# EAGLE design Audio Spektrum Analysator (EAGLE 9.1.1)
ERSTELLER: Jakob Holz; PROJEKT: Audio Spektrumanalysator; VERSION: 1.0

## Sheet 1 of 5
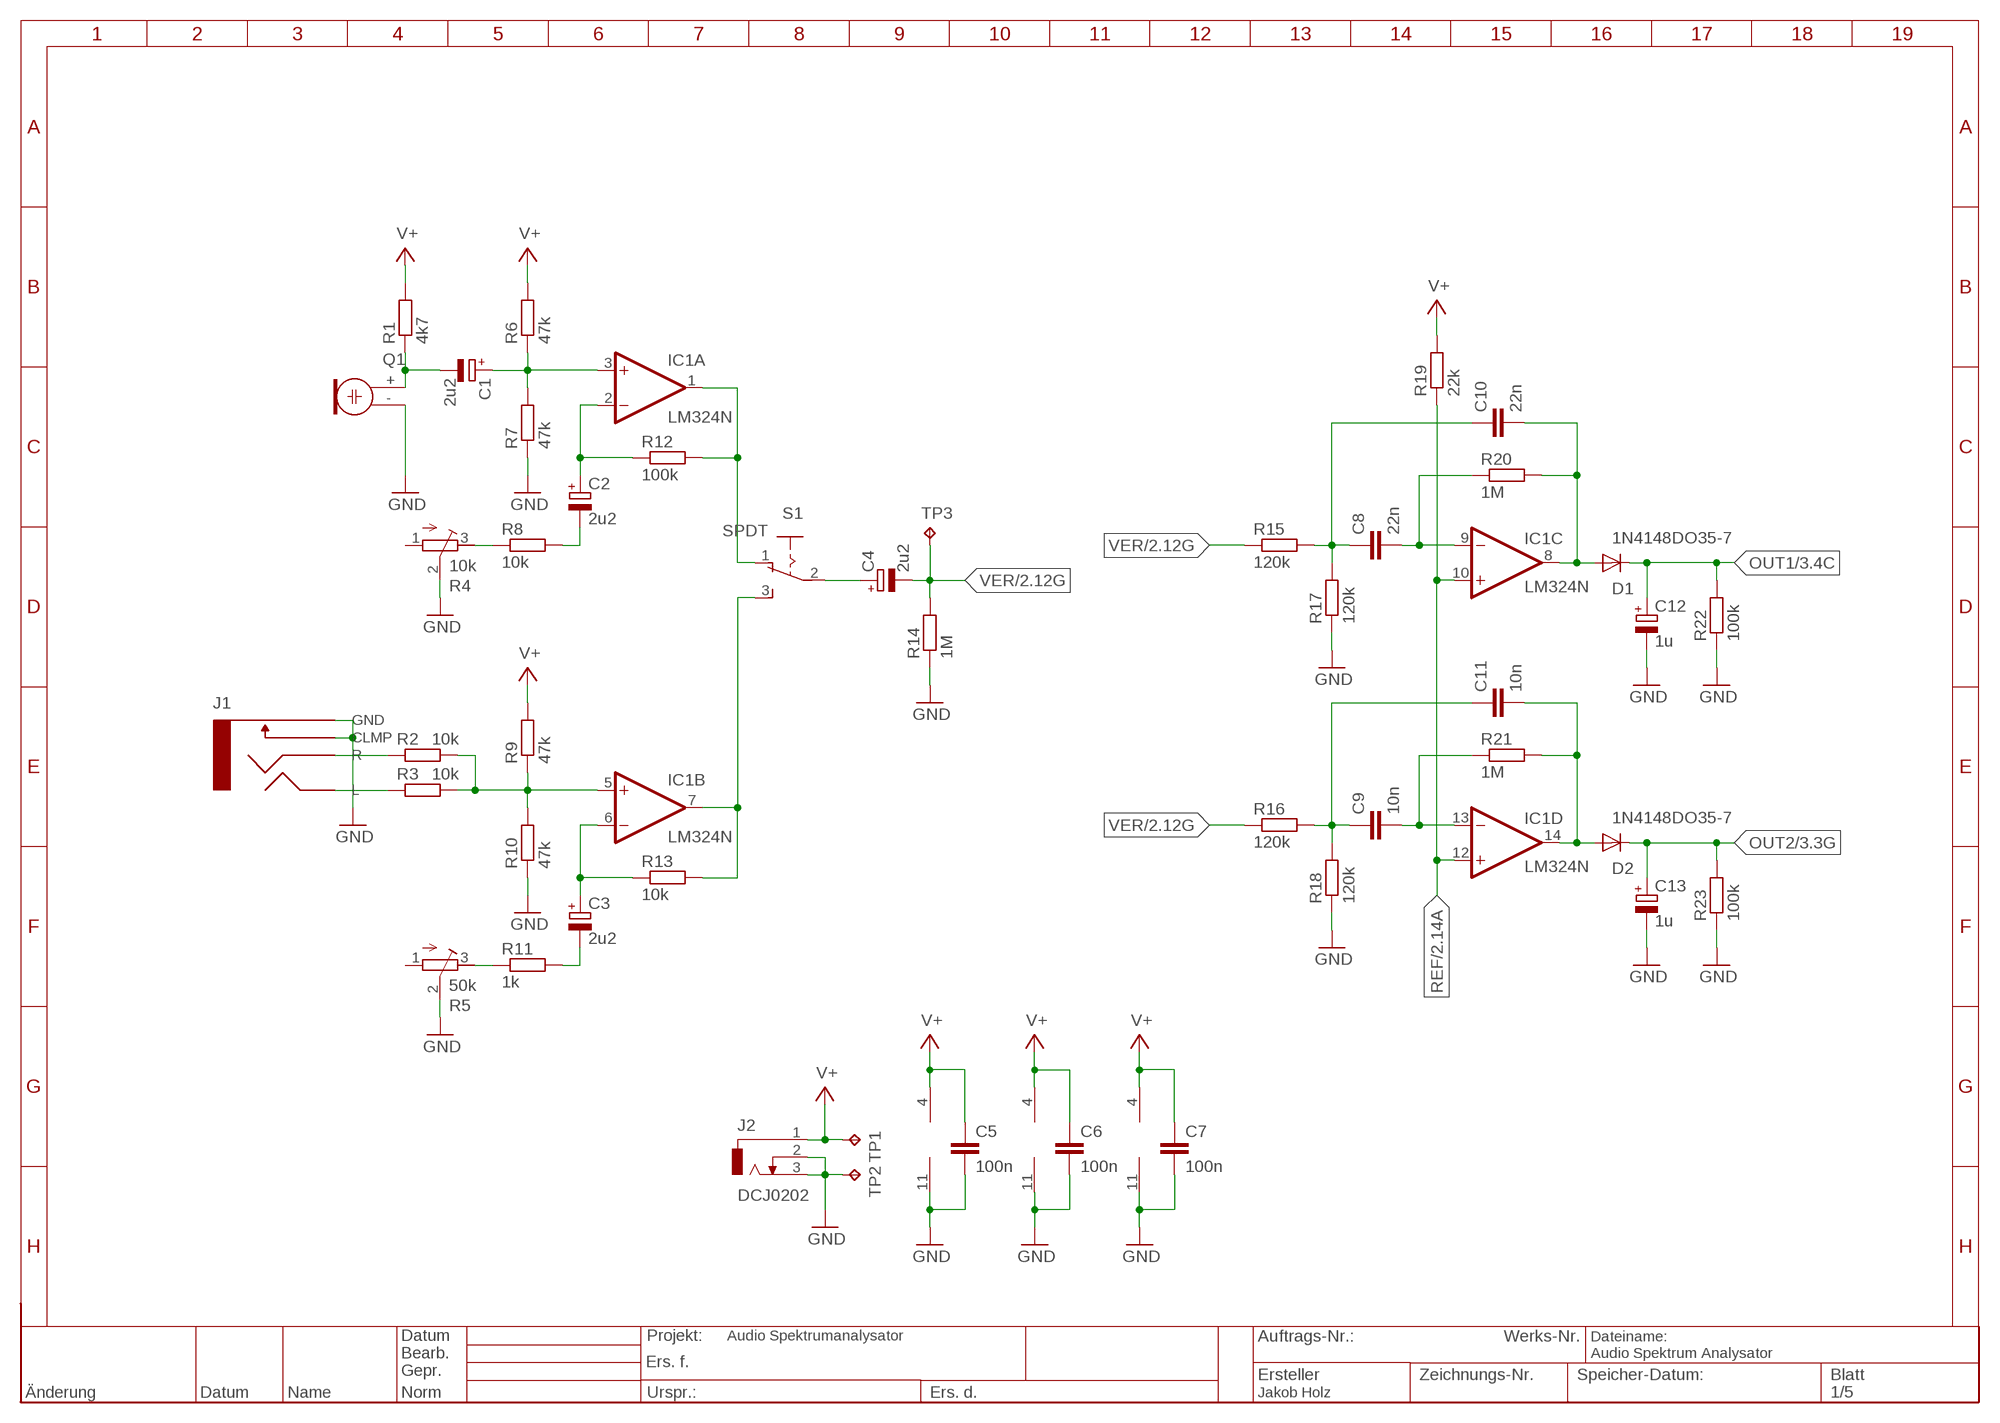
[diagram p0: schematic, sheet 1]

### Parts
C1  2u2  CPOL-EUE2.5-5  [E2,5-5]
C2  2u2  CPOL-EUE2.5-5  [E2,5-5]
C3  2u2  CPOL-EUE2.5-5  [E2,5-5]
C4  2u2  CPOL-EUE2.5-5  [E2,5-5]
C5  100n  C-EU050-024X044  [C050-024X044]
C6  100n  C-EU050-024X044  [C050-024X044]
C7  100n  C-EU050-024X044  [C050-024X044]
C8  22n  C-EU025-024X044  [C025-024X044]
C9  10n  C-EU025-024X044  [C025-024X044]
C10  22n  C-EU025-024X044  [C025-024X044]
C11  10n  C-EU025-024X044  [C025-024X044]
C12  1u  CPOL-EUE2.5-5  [E2,5-5]
C13  1u  CPOL-EUE2.5-5  [E2,5-5]
D1  1N4148DO35-7  [DO35-7]
D2  1N4148DO35-7  [DO35-7]
IC1  LM324N  [DIL14]
IC2  LM324N  [DIL14]
IC3  LM324N  [DIL14]
J1  2.5MM-AUXS  [2,5MM-AUX_JACK]
J2  DCJ0202  [DCJ0202]
Q1  ELECTRET  [9.7ELECTRET]
R1  4k7  R-EU_0207/7  [0207/7]
R2  10k  R-EU_0207/7  [0207/7]
R3  10k  R-EU_0207/7  [0207/7]
R4  10k  R-TRIMM64W  [RTRIM64W]
R5  50k  R-TRIMM64W  [RTRIM64W]
R6  47k  R-EU_0207/7  [0207/7]
R7  47k  R-EU_0207/7  [0207/7]
R8  10k  R-EU_0207/7  [0207/7]
R9  47k  R-EU_0207/7  [0207/7]
R10  47k  R-EU_0207/7  [0207/7]
R11  1k  R-EU_0207/7  [0207/7]
R12  100k  R-EU_0207/7  [0207/7]
R13  10k  R-EU_0207/7  [0207/7]
R14  1M  R-EU_0207/7  [0207/7]
R15  120k  R-EU_0207/7  [0207/7]
R16  120k  R-EU_0207/7  [0207/7]
R17  120k  R-EU_0207/7  [0207/7]
R18  120k  R-EU_0207/7  [0207/7]
R19  22k  R-EU_0207/7  [0207/7]
R20  1M  R-EU_0207/7  [0207/7]
R21  1M  R-EU_0207/7  [0207/7]
R22  100k  R-EU_0207/7  [0207/7]
R23  100k  R-EU_0207/7  [0207/7]
S1  SPDT  [SPDT]
TP1  TPPAD1-20  [P1-20]
TP2  TPPAD1-20  [P1-20]
TP3  TPPAD1-20  [P1-20]

### Nets
GND: C5.2 C6.2 C7.2 C12.- C13.- IC1.11(P:V-) IC2.11(P:V-) IC3.11(P:V-) J1.1(GND) J1.4(CLMP) J2.2 J2.3 Q1.- R4.2(S) R5.2(S) R7.1 R10.1 R14.1 R17.1 R18.1 R22.1 R23.1 TP2.TP ; also sheet 2,3,4,5
N$1: J1.2(R) R2.1
N$2: J1.3(L) R3.1
N$3: IC1.5(B:+IN) R2.2 R3.2 R9.1 R10.2
N$4: C1.+ IC1.3(A:+IN) R6.1 R7.2
N$5: C2.+ IC1.2(A:-IN) R12.1
N$6: IC1.1(A:OUT) R12.2 S1.1
N$10: IC1.7(B:OUT) R13.2 S1.3
N$12: C4.+ S1.2
N$13: C1.- Q1.+ R1.1
N$31: C2.- R8.2
N$44: R4.3(E) R8.1
N$57: C3.+ IC1.6(B:-IN) R13.1
N$70: C3.- R11.2
N$83: R5.3(E) R11.1
N$133: C10.2 D1.A IC1.8(C:OUT) R20.2
N$134: C8.2 IC1.9(C:-IN) R20.1
N$136: C8.1 C10.1 R15.2 R17.2
N$138: C11.2 D2.A IC1.14(D:OUT) R21.2
N$139: C9.2 IC1.13(D:-IN) R21.1
N$141: C9.1 C11.1 R16.2 R18.2
OUT1: C12.+ D1.C R22.2 ; also sheet 3
OUT2: C13.+ D2.C R23.2 ; also sheet 3
REF: IC1.10(C:+IN) IC1.12(D:+IN) R19.1 ; also sheet 2
V+ [V+]: C5.1 C6.1 C7.1 IC1.4(P:V+) IC2.4(P:V+) IC3.4(P:V+) J2.1 R1.2 R6.2 R9.2 R19.2 TP1.TP ; also sheet 3,4,5
VER: C4.- R14.2 R15.1 R16.1 TP3.TP ; also sheet 2
Unconnected: R4.1(A) R5.1(A)

## Sheet 2 of 5
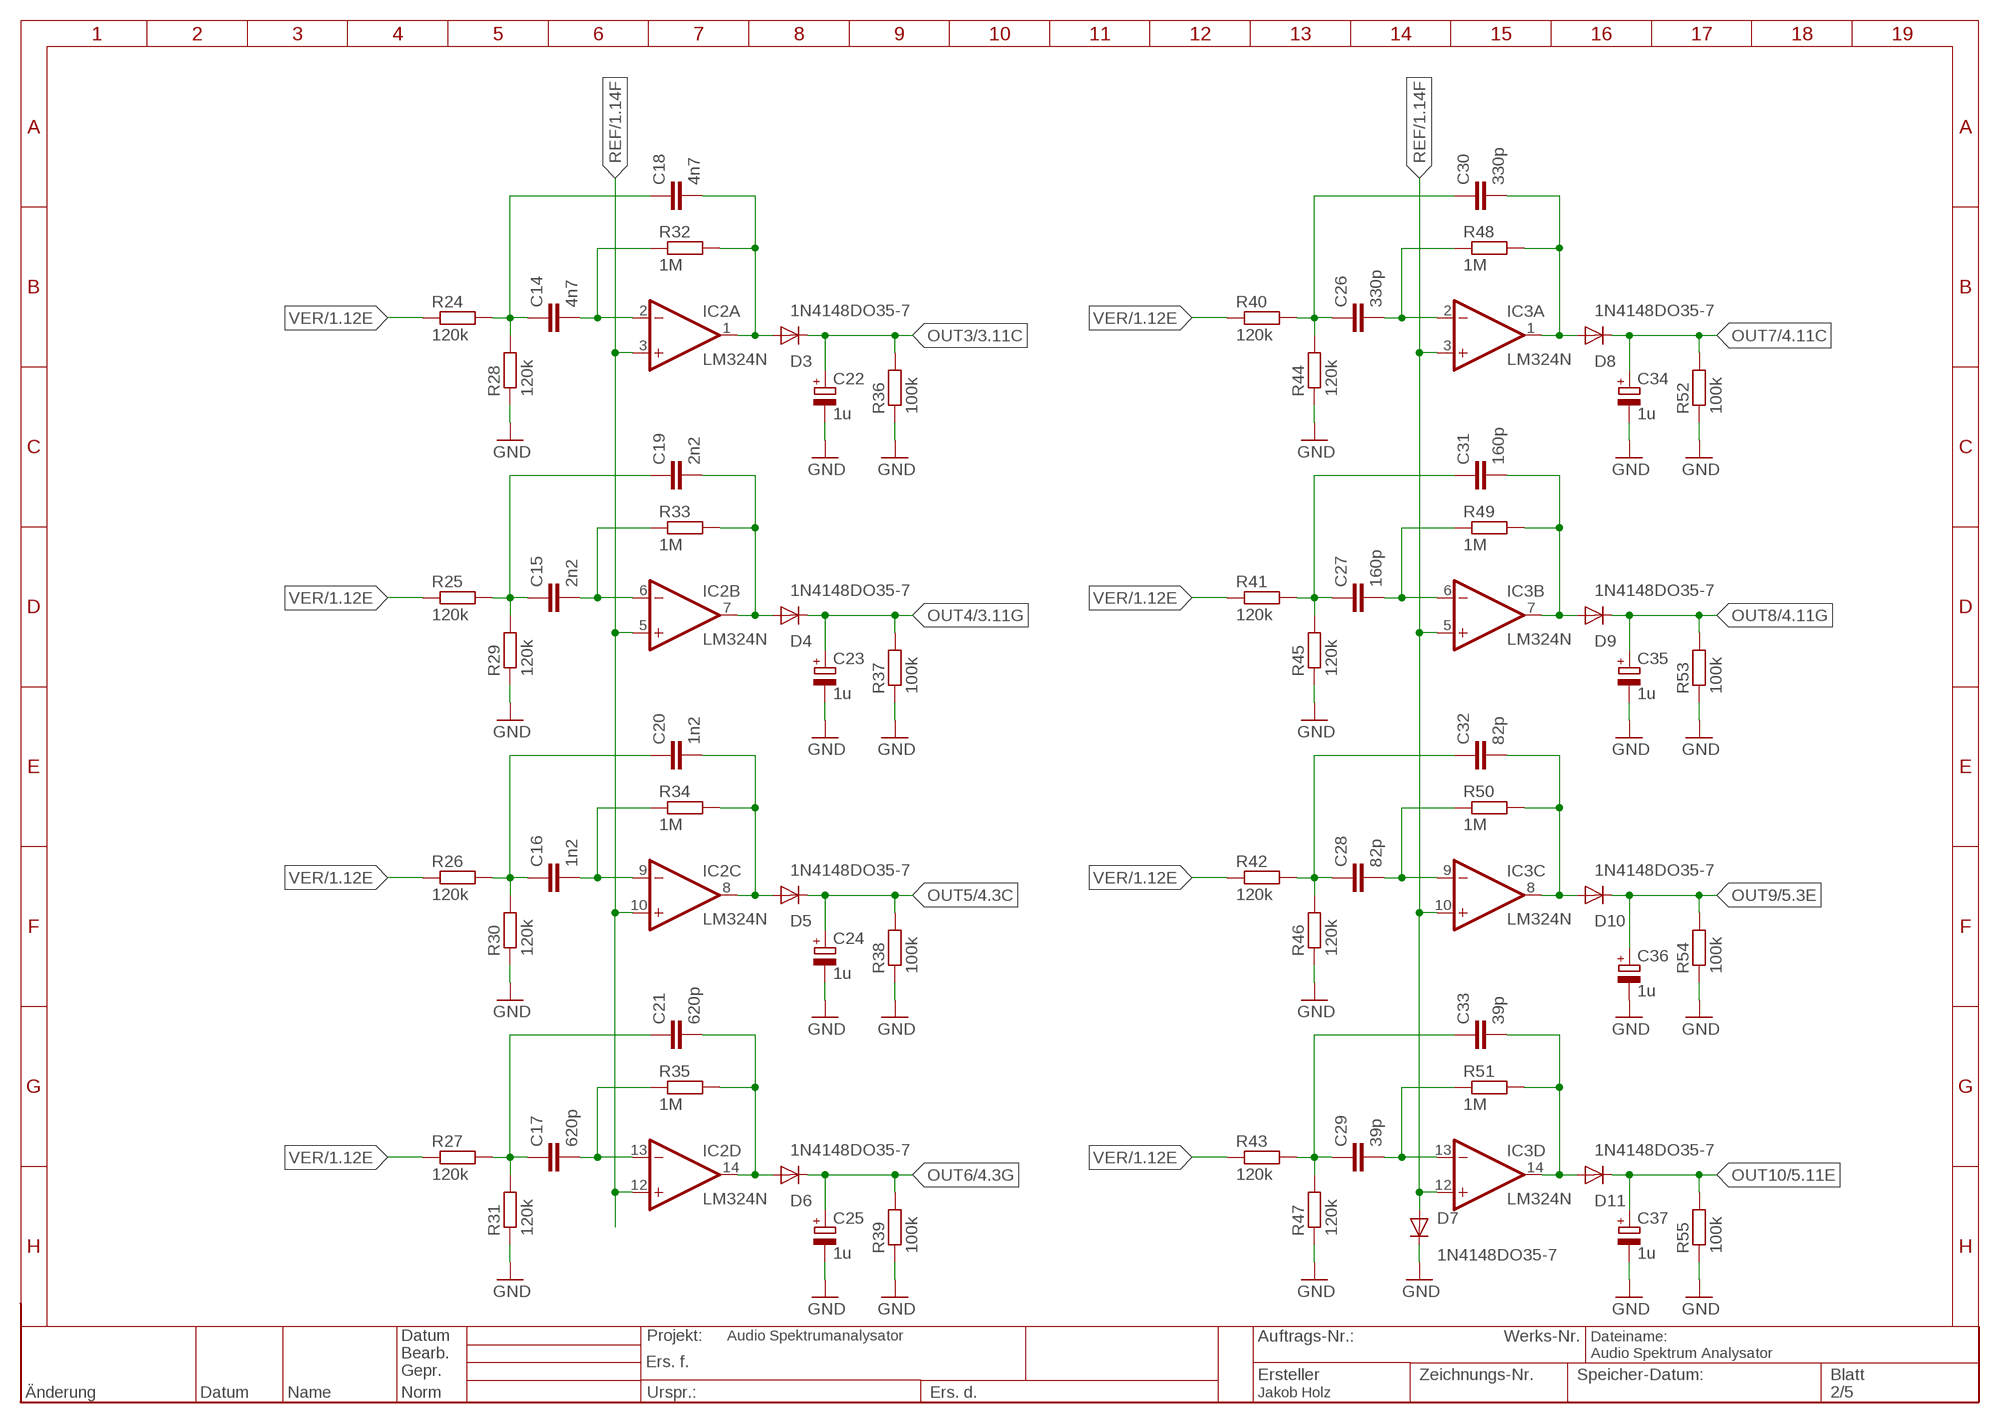
[diagram p1: schematic, sheet 2]

### Parts
C14  4n7  C-EU025-024X044  [C025-024X044]
C15  2n2  C-EU025-024X044  [C025-024X044]
C16  1n2  C-EU025-024X044  [C025-024X044]
C17  620p  C-EU025-024X044  [C025-024X044]
C18  4n7  C-EU025-024X044  [C025-024X044]
C19  2n2  C-EU025-024X044  [C025-024X044]
C20  1n2  C-EU025-024X044  [C025-024X044]
C21  620p  C-EU025-024X044  [C025-024X044]
C22  1u  CPOL-EUE2.5-5  [E2,5-5]
C23  1u  CPOL-EUE2.5-5  [E2,5-5]
C24  1u  CPOL-EUE2.5-5  [E2,5-5]
C25  1u  CPOL-EUE2.5-5  [E2,5-5]
C26  330p  C-EU025-024X044  [C025-024X044]
C27  160p  C-EU025-024X044  [C025-024X044]
C28  82p  C-EU025-024X044  [C025-024X044]
C29  39p  C-EU025-024X044  [C025-024X044]
C30  330p  C-EU025-024X044  [C025-024X044]
C31  160p  C-EU025-024X044  [C025-024X044]
C32  82p  C-EU025-024X044  [C025-024X044]
C33  39p  C-EU025-024X044  [C025-024X044]
C34  1u  CPOL-EUE2.5-5  [E2,5-5]
C35  1u  CPOL-EUE2.5-5  [E2,5-5]
C36  1u  CPOL-EUE2.5-5  [E2,5-5]
C37  1u  CPOL-EUE2.5-5  [E2,5-5]
D3  1N4148DO35-7  [DO35-7]
D4  1N4148DO35-7  [DO35-7]
D5  1N4148DO35-7  [DO35-7]
D6  1N4148DO35-7  [DO35-7]
D7  1N4148DO35-7  [DO35-7]
D8  1N4148DO35-7  [DO35-7]
D9  1N4148DO35-7  [DO35-7]
D10  1N4148DO35-7  [DO35-7]
D11  1N4148DO35-7  [DO35-7]
R24  120k  R-EU_0207/7  [0207/7]
R25  120k  R-EU_0207/7  [0207/7]
R26  120k  R-EU_0207/7  [0207/7]
R27  120k  R-EU_0207/7  [0207/7]
R28  120k  R-EU_0207/7  [0207/7]
R29  120k  R-EU_0207/7  [0207/7]
R30  120k  R-EU_0207/7  [0207/7]
R31  120k  R-EU_0207/7  [0207/7]
R32  1M  R-EU_0207/7  [0207/7]
R33  1M  R-EU_0207/7  [0207/7]
R34  1M  R-EU_0207/7  [0207/7]
R35  1M  R-EU_0207/7  [0207/7]
R36  100k  R-EU_0207/7  [0207/7]
R37  100k  R-EU_0207/7  [0207/7]
R38  100k  R-EU_0207/7  [0207/7]
R39  100k  R-EU_0207/7  [0207/7]
R40  120k  R-EU_0207/7  [0207/7]
R41  120k  R-EU_0207/7  [0207/7]
R42  120k  R-EU_0207/7  [0207/7]
R43  120k  R-EU_0207/7  [0207/7]
R44  120k  R-EU_0207/7  [0207/7]
R45  120k  R-EU_0207/7  [0207/7]
R46  120k  R-EU_0207/7  [0207/7]
R47  120k  R-EU_0207/7  [0207/7]
R48  1M  R-EU_0207/7  [0207/7]
R49  1M  R-EU_0207/7  [0207/7]
R50  1M  R-EU_0207/7  [0207/7]
R51  1M  R-EU_0207/7  [0207/7]
R52  100k  R-EU_0207/7  [0207/7]
R53  100k  R-EU_0207/7  [0207/7]
R54  100k  R-EU_0207/7  [0207/7]
R55  100k  R-EU_0207/7  [0207/7]

### Nets
GND: C22.- C23.- C24.- C25.- C34.- C35.- C36.- C37.- D7.C R28.1 R29.1 R30.1 R31.1 R36.1 R37.1 R38.1 R39.1 R44.1 R45.1 R46.1 R47.1 R52.1 R53.1 R54.1 R55.1 ; also sheet 1,3,4,5
N$125: C18.2 D3.A IC2.1(A:OUT) R32.2
N$130: C14.2 IC2.2(A:-IN) R32.1
N$135: C21.2 D6.A IC2.14(D:OUT) R35.2
N$140: C14.1 C18.1 R24.2 R28.2
N$144: C19.2 D4.A IC2.7(B:OUT) R33.2
N$145: C15.2 IC2.6(B:-IN) R33.1
N$146: C17.2 IC2.13(D:-IN) R35.1
N$147: C15.1 C19.1 R25.2 R29.2
N$149: C20.2 D5.A IC2.8(C:OUT) R34.2
N$150: C16.2 IC2.9(C:-IN) R34.1
N$151: C30.2 D8.A IC3.1(A:OUT) R48.2
N$152: C16.1 C20.1 R26.2 R30.2
N$154: C17.1 C21.1 R27.2 R31.2
N$156: C26.2 IC3.2(A:-IN) R48.1
N$157: C26.1 C30.1 R40.2 R44.2
N$159: C31.2 D9.A IC3.7(B:OUT) R49.2
N$160: C27.2 IC3.6(B:-IN) R49.1
N$161: C27.1 C31.1 R41.2 R45.2
N$163: C32.2 D10.A IC3.8(C:OUT) R50.2
N$164: C28.2 IC3.9(C:-IN) R50.1
N$165: C28.1 C32.1 R42.2 R46.2
N$167: C33.2 D11.A IC3.14(D:OUT) R51.2
N$168: C29.2 IC3.13(D:-IN) R51.1
N$169: C29.1 C33.1 R43.2 R47.2
OUT3: C22.+ D3.C R36.2 ; also sheet 3
OUT4: C23.+ D4.C R37.2 ; also sheet 3
OUT5: C24.+ D5.C R38.2 ; also sheet 4
OUT6: C25.+ D6.C R39.2 ; also sheet 4
OUT7: C34.+ D8.C R52.2 ; also sheet 4
OUT8: C35.+ D9.C R53.2 ; also sheet 4
OUT9: C36.+ D10.C R54.2 ; also sheet 5
OUT10: C37.+ D11.C R55.2 ; also sheet 5
REF: D7.A IC2.3(A:+IN) IC2.5(B:+IN) IC2.10(C:+IN) IC2.12(D:+IN) IC3.3(A:+IN) IC3.5(B:+IN) IC3.10(C:+IN) IC3.12(D:+IN) ; also sheet 1
VER: R24.1 R25.1 R26.1 R27.1 R40.1 R41.1 R42.1 R43.1 ; also sheet 1

## Sheet 3 of 5
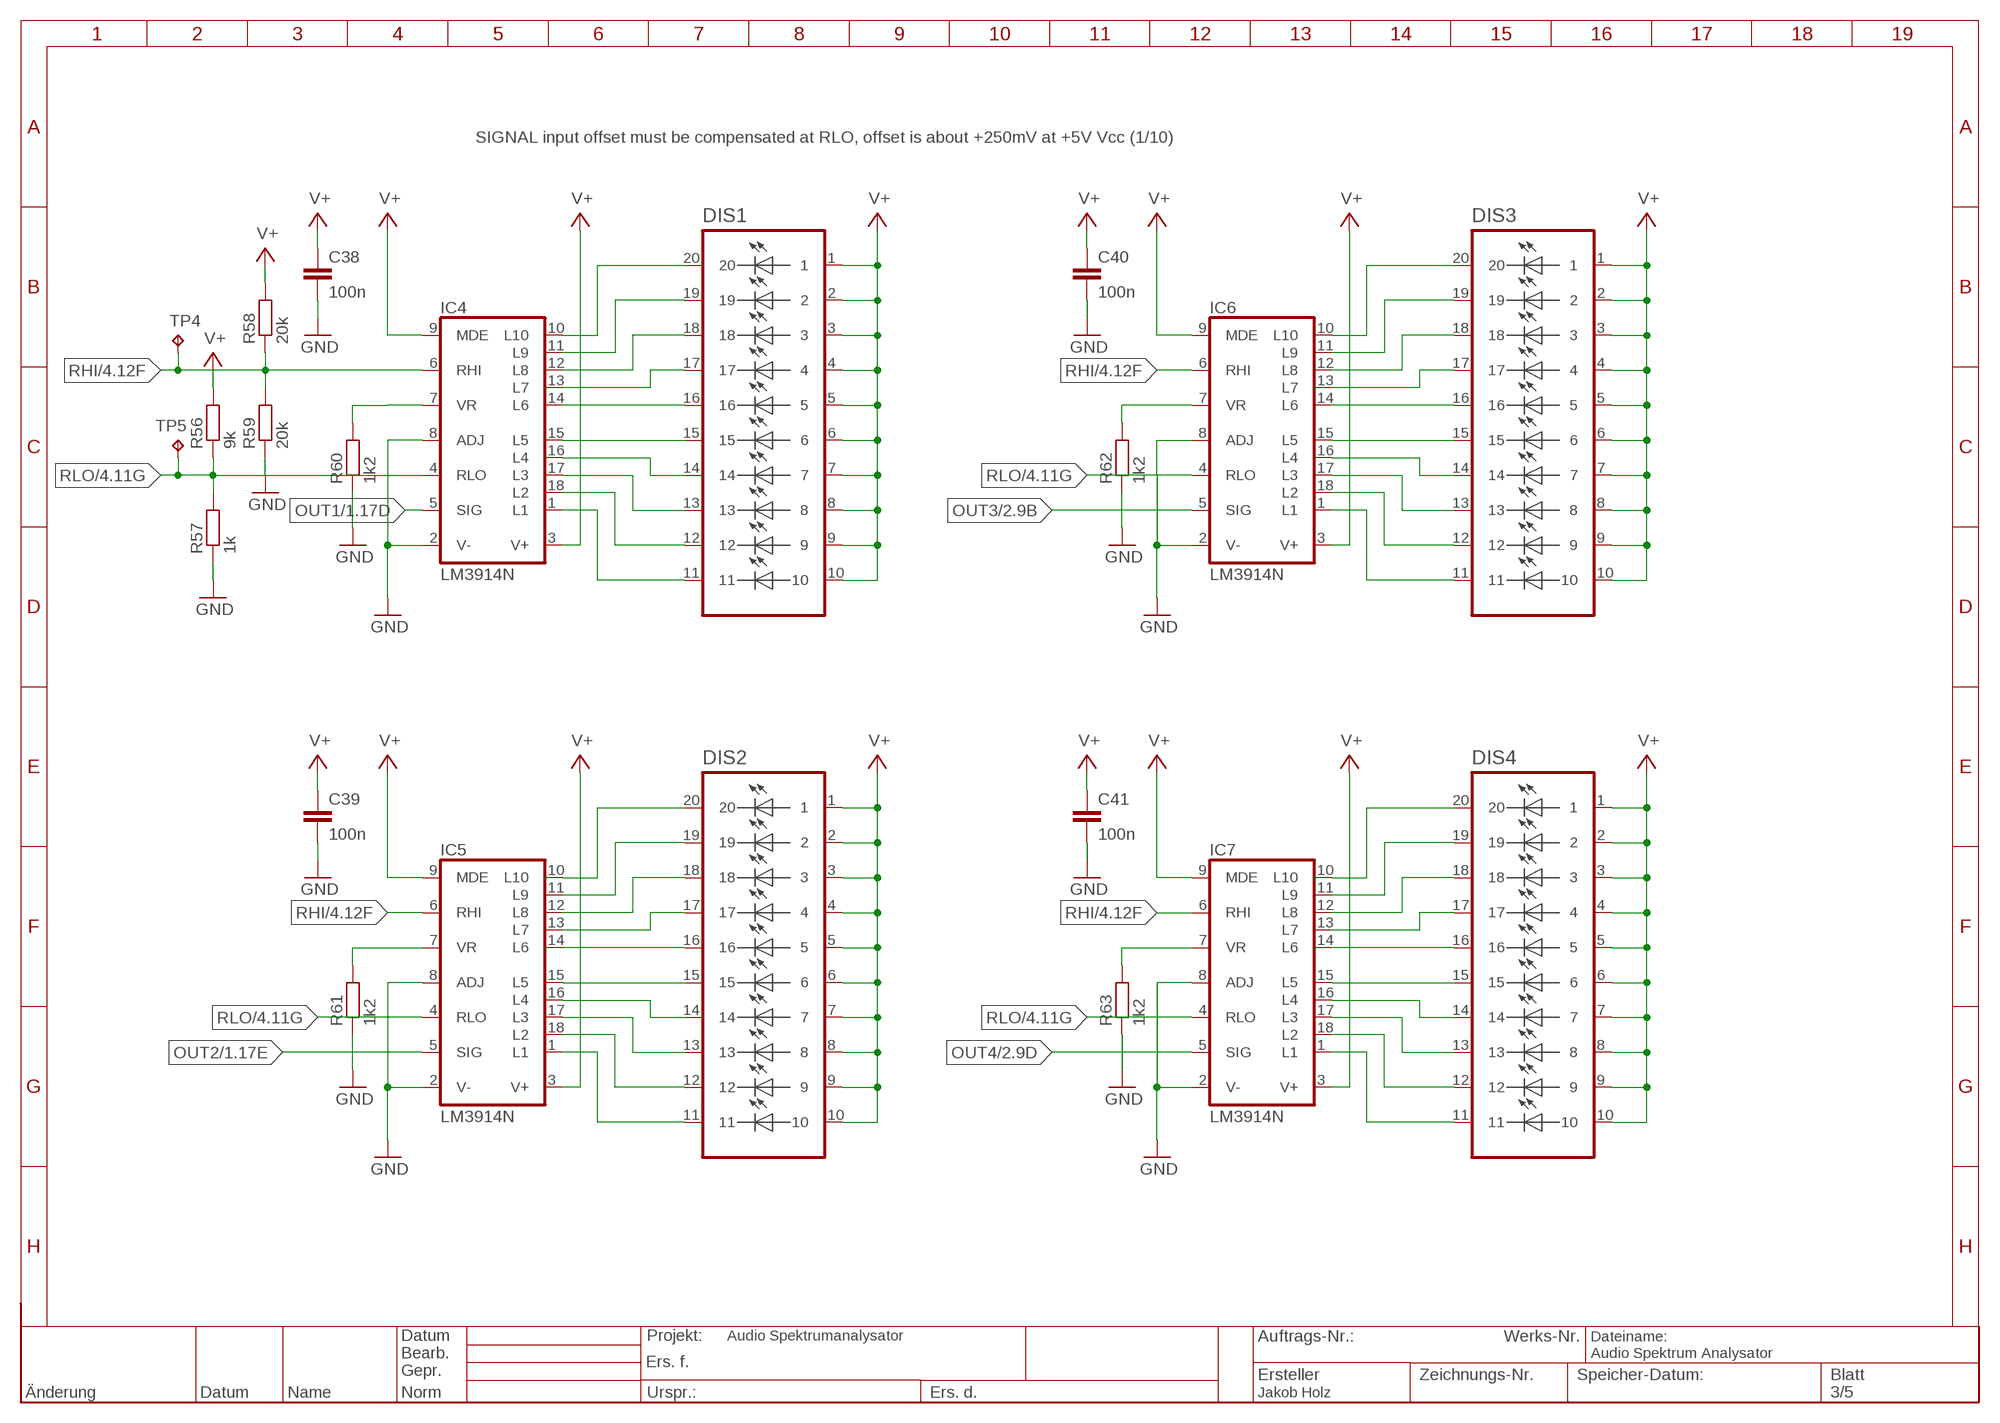
[diagram p2: schematic, sheet 3]

### Parts
C38  100n  C-EU050-024X044  [C050-024X044]
C39  100n  C-EU050-024X044  [C050-024X044]
C40  100n  C-EU050-024X044  [C050-024X044]
C41  100n  C-EU050-024X044  [C050-024X044]
DIS1  SHB10R  [SHB10R]
DIS2  SHB10R  [SHB10R]
DIS3  SHB10R  [SHB10R]
DIS4  SHB10R  [SHB10R]
IC4  LM3914N  [DIL18]
IC5  LM3914N  [DIL18]
IC6  LM3914N  [DIL18]
IC7  LM3914N  [DIL18]
R56  9k  R-EU_0207/7  [0207/7]
R57  1k  R-EU_0207/7  [0207/7]
R58  20k  R-EU_0207/7  [0207/7]
R59  20k  R-EU_0207/7  [0207/7]
R60  1k2  R-EU_0207/7  [0207/7]
R61  1k2  R-EU_0207/7  [0207/7]
R62  1k2  R-EU_0207/7  [0207/7]
R63  1k2  R-EU_0207/7  [0207/7]
TP4  TPPAD1-20  [P1-20]
TP5  TPPAD1-20  [P1-20]

### Nets
GND: C38.2 C39.2 C40.2 C41.2 IC4.2(V-) IC4.8(ADJ) IC5.2(V-) IC5.8(ADJ) IC6.2(V-) IC6.8(ADJ) IC7.2(V-) IC7.8(ADJ) R57.1 R59.1 R60.1 R61.1 R62.1 R63.1 ; also sheet 1,2,4,5
N$7: DIS3.15 IC6.15(L5)
N$8: DIS3.14 IC6.16(L4)
N$9: DIS3.13 IC6.17(L3)
N$11: DIS3.12 IC6.18(L2)
N$17: DIS3.11 IC6.1(L1)
N$18: DIS3.16 IC6.14(L6)
N$19: DIS3.17 IC6.13(L7)
N$26: DIS3.18 IC6.12(L8)
N$27: DIS3.19 IC6.11(L9)
N$28: DIS3.20 IC6.10(L10)
N$29: IC6.7(VR) R62.2
N$30: IC5.7(VR) R61.2
N$32: DIS2.15 IC5.15(L5)
N$33: DIS2.14 IC5.16(L4)
N$34: DIS2.13 IC5.17(L3)
N$35: DIS2.12 IC5.18(L2)
N$36: DIS2.11 IC5.1(L1)
N$37: DIS2.16 IC5.14(L6)
N$38: DIS2.17 IC5.13(L7)
N$39: DIS2.18 IC5.12(L8)
N$40: DIS2.19 IC5.11(L9)
N$41: DIS2.20 IC5.10(L10)
N$42: IC7.7(VR) R63.2
N$45: DIS4.15 IC7.15(L5)
N$46: DIS4.14 IC7.16(L4)
N$47: DIS4.13 IC7.17(L3)
N$48: DIS4.12 IC7.18(L2)
N$49: DIS4.11 IC7.1(L1)
N$50: DIS4.16 IC7.14(L6)
N$51: DIS4.17 IC7.13(L7)
N$52: DIS4.18 IC7.12(L8)
N$53: DIS4.19 IC7.11(L9)
N$54: DIS4.20 IC7.10(L10)
N$97: DIS1.15 IC4.15(L5)
N$98: DIS1.14 IC4.16(L4)
N$99: DIS1.13 IC4.17(L3)
N$100: DIS1.12 IC4.18(L2)
N$101: DIS1.11 IC4.1(L1)
N$102: DIS1.16 IC4.14(L6)
N$103: DIS1.17 IC4.13(L7)
N$104: DIS1.18 IC4.12(L8)
N$105: DIS1.19 IC4.11(L9)
N$106: DIS1.20 IC4.10(L10)
N$108: IC4.7(VR) R60.2
OUT1: IC4.5(SIG) ; also sheet 1
OUT2: IC5.5(SIG) ; also sheet 1
OUT3: IC6.5(SIG) ; also sheet 2
OUT4: IC7.5(SIG) ; also sheet 2
RHI: IC4.6(RHI) IC5.6(RHI) IC6.6(RHI) IC7.6(RHI) R58.1 R59.2 TP4.TP ; also sheet 4,5
RLO: IC4.4(RLO) IC5.4(RLO) IC6.4(RLO) IC7.4(RLO) R56.1 R57.2 TP5.TP ; also sheet 4,5
V+ [V+]: C38.1 C39.1 C40.1 C41.1 DIS1.1 DIS1.2 DIS1.3 DIS1.4 DIS1.5 DIS1.6 DIS1.7 DIS1.8 DIS1.9 DIS1.10 DIS2.1 DIS2.2 DIS2.3 DIS2.4 DIS2.5 DIS2.6 DIS2.7 DIS2.8 DIS2.9 DIS2.10 DIS3.1 DIS3.2 DIS3.3 DIS3.4 DIS3.5 DIS3.6 DIS3.7 DIS3.8 DIS3.9 DIS3.10 DIS4.1 DIS4.2 DIS4.3 DIS4.4 DIS4.5 DIS4.6 DIS4.7 DIS4.8 DIS4.9 DIS4.10 IC4.3(V+) IC4.9(MDE) IC5.3(V+) IC5.9(MDE) IC6.3(V+) IC6.9(MDE) IC7.3(V+) IC7.9(MDE) R56.2 R58.2 ; also sheet 1,4,5

### Notes on the sheet
- SIGNAL input offset must be compensated at RLO, offset is about +250mV at +5V Vcc (1/10)

## Sheet 4 of 5
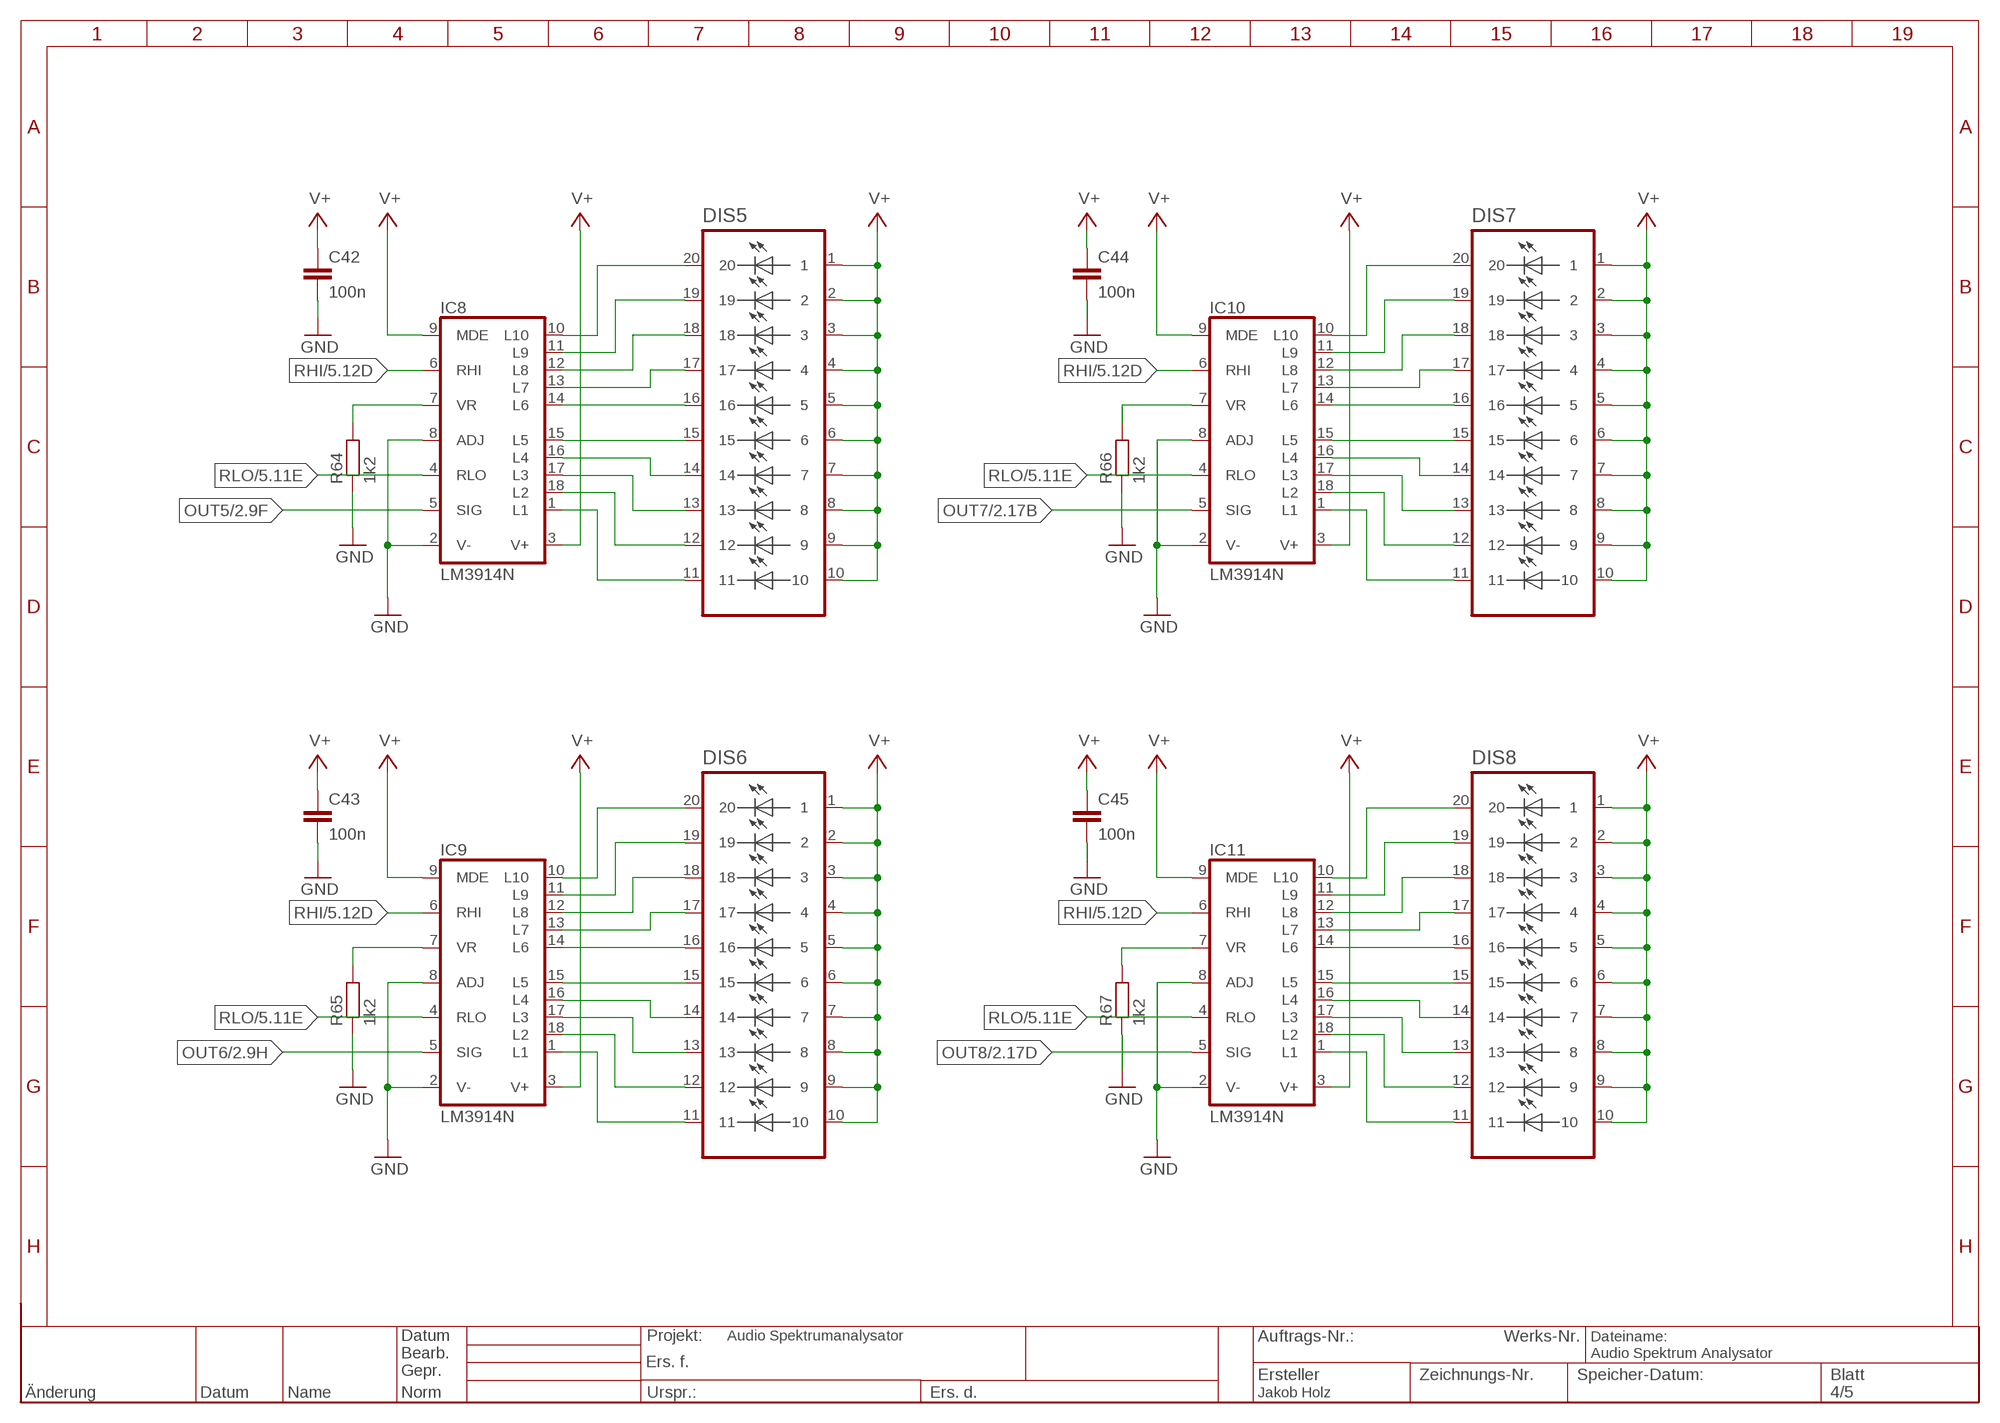
[diagram p3: schematic, sheet 4]

### Parts
C42  100n  C-EU050-024X044  [C050-024X044]
C43  100n  C-EU050-024X044  [C050-024X044]
C44  100n  C-EU050-024X044  [C050-024X044]
C45  100n  C-EU050-024X044  [C050-024X044]
DIS5  SHB10R  [SHB10R]
DIS6  SHB10R  [SHB10R]
DIS7  SHB10R  [SHB10R]
DIS8  SHB10R  [SHB10R]
IC8  LM3914N  [DIL18]
IC9  LM3914N  [DIL18]
IC10  LM3914N  [DIL18]
IC11  LM3914N  [DIL18]
R64  1k2  R-EU_0207/7  [0207/7]
R65  1k2  R-EU_0207/7  [0207/7]
R66  1k2  R-EU_0207/7  [0207/7]
R67  1k2  R-EU_0207/7  [0207/7]

### Nets
GND: C42.2 C43.2 C44.2 C45.2 IC8.2(V-) IC8.8(ADJ) IC9.2(V-) IC9.8(ADJ) IC10.2(V-) IC10.8(ADJ) IC11.2(V-) IC11.8(ADJ) R64.1 R65.1 R66.1 R67.1 ; also sheet 1,2,3,5
N$43: IC8.7(VR) R64.2
N$55: IC10.7(VR) R66.2
N$56: IC9.7(VR) R65.2
N$58: DIS5.15 IC8.15(L5)
N$59: DIS5.14 IC8.16(L4)
N$60: DIS5.13 IC8.17(L3)
N$61: DIS5.12 IC8.18(L2)
N$62: DIS5.11 IC8.1(L1)
N$63: DIS5.16 IC8.14(L6)
N$64: DIS5.17 IC8.13(L7)
N$65: DIS5.18 IC8.12(L8)
N$66: DIS5.19 IC8.11(L9)
N$67: DIS5.20 IC8.10(L10)
N$68: IC11.7(VR) R67.2
N$71: DIS7.15 IC10.15(L5)
N$72: DIS7.14 IC10.16(L4)
N$73: DIS7.13 IC10.17(L3)
N$74: DIS7.12 IC10.18(L2)
N$75: DIS7.11 IC10.1(L1)
N$76: DIS7.16 IC10.14(L6)
N$77: DIS7.17 IC10.13(L7)
N$78: DIS7.18 IC10.12(L8)
N$79: DIS7.19 IC10.11(L9)
N$80: DIS7.20 IC10.10(L10)
N$84: DIS6.15 IC9.15(L5)
N$85: DIS6.14 IC9.16(L4)
N$86: DIS6.13 IC9.17(L3)
N$87: DIS6.12 IC9.18(L2)
N$88: DIS6.11 IC9.1(L1)
N$89: DIS6.16 IC9.14(L6)
N$90: DIS6.17 IC9.13(L7)
N$91: DIS6.18 IC9.12(L8)
N$92: DIS6.19 IC9.11(L9)
N$93: DIS6.20 IC9.10(L10)
N$110: DIS8.15 IC11.15(L5)
N$111: DIS8.14 IC11.16(L4)
N$112: DIS8.13 IC11.17(L3)
N$113: DIS8.12 IC11.18(L2)
N$114: DIS8.11 IC11.1(L1)
N$115: DIS8.16 IC11.14(L6)
N$116: DIS8.17 IC11.13(L7)
N$117: DIS8.18 IC11.12(L8)
N$118: DIS8.19 IC11.11(L9)
N$119: DIS8.20 IC11.10(L10)
OUT5: IC8.5(SIG) ; also sheet 2
OUT6: IC9.5(SIG) ; also sheet 2
OUT7: IC10.5(SIG) ; also sheet 2
OUT8: IC11.5(SIG) ; also sheet 2
RHI: IC8.6(RHI) IC9.6(RHI) IC10.6(RHI) IC11.6(RHI) ; also sheet 3,5
RLO: IC8.4(RLO) IC9.4(RLO) IC10.4(RLO) IC11.4(RLO) ; also sheet 3,5
V+ [V+]: C42.1 C43.1 C44.1 C45.1 DIS5.1 DIS5.2 DIS5.3 DIS5.4 DIS5.5 DIS5.6 DIS5.7 DIS5.8 DIS5.9 DIS5.10 DIS6.1 DIS6.2 DIS6.3 DIS6.4 DIS6.5 DIS6.6 DIS6.7 DIS6.8 DIS6.9 DIS6.10 DIS7.1 DIS7.2 DIS7.3 DIS7.4 DIS7.5 DIS7.6 DIS7.7 DIS7.8 DIS7.9 DIS7.10 DIS8.1 DIS8.2 DIS8.3 DIS8.4 DIS8.5 DIS8.6 DIS8.7 DIS8.8 DIS8.9 DIS8.10 IC8.3(V+) IC8.9(MDE) IC9.3(V+) IC9.9(MDE) IC10.3(V+) IC10.9(MDE) IC11.3(V+) IC11.9(MDE) ; also sheet 1,3,5

## Sheet 5 of 5
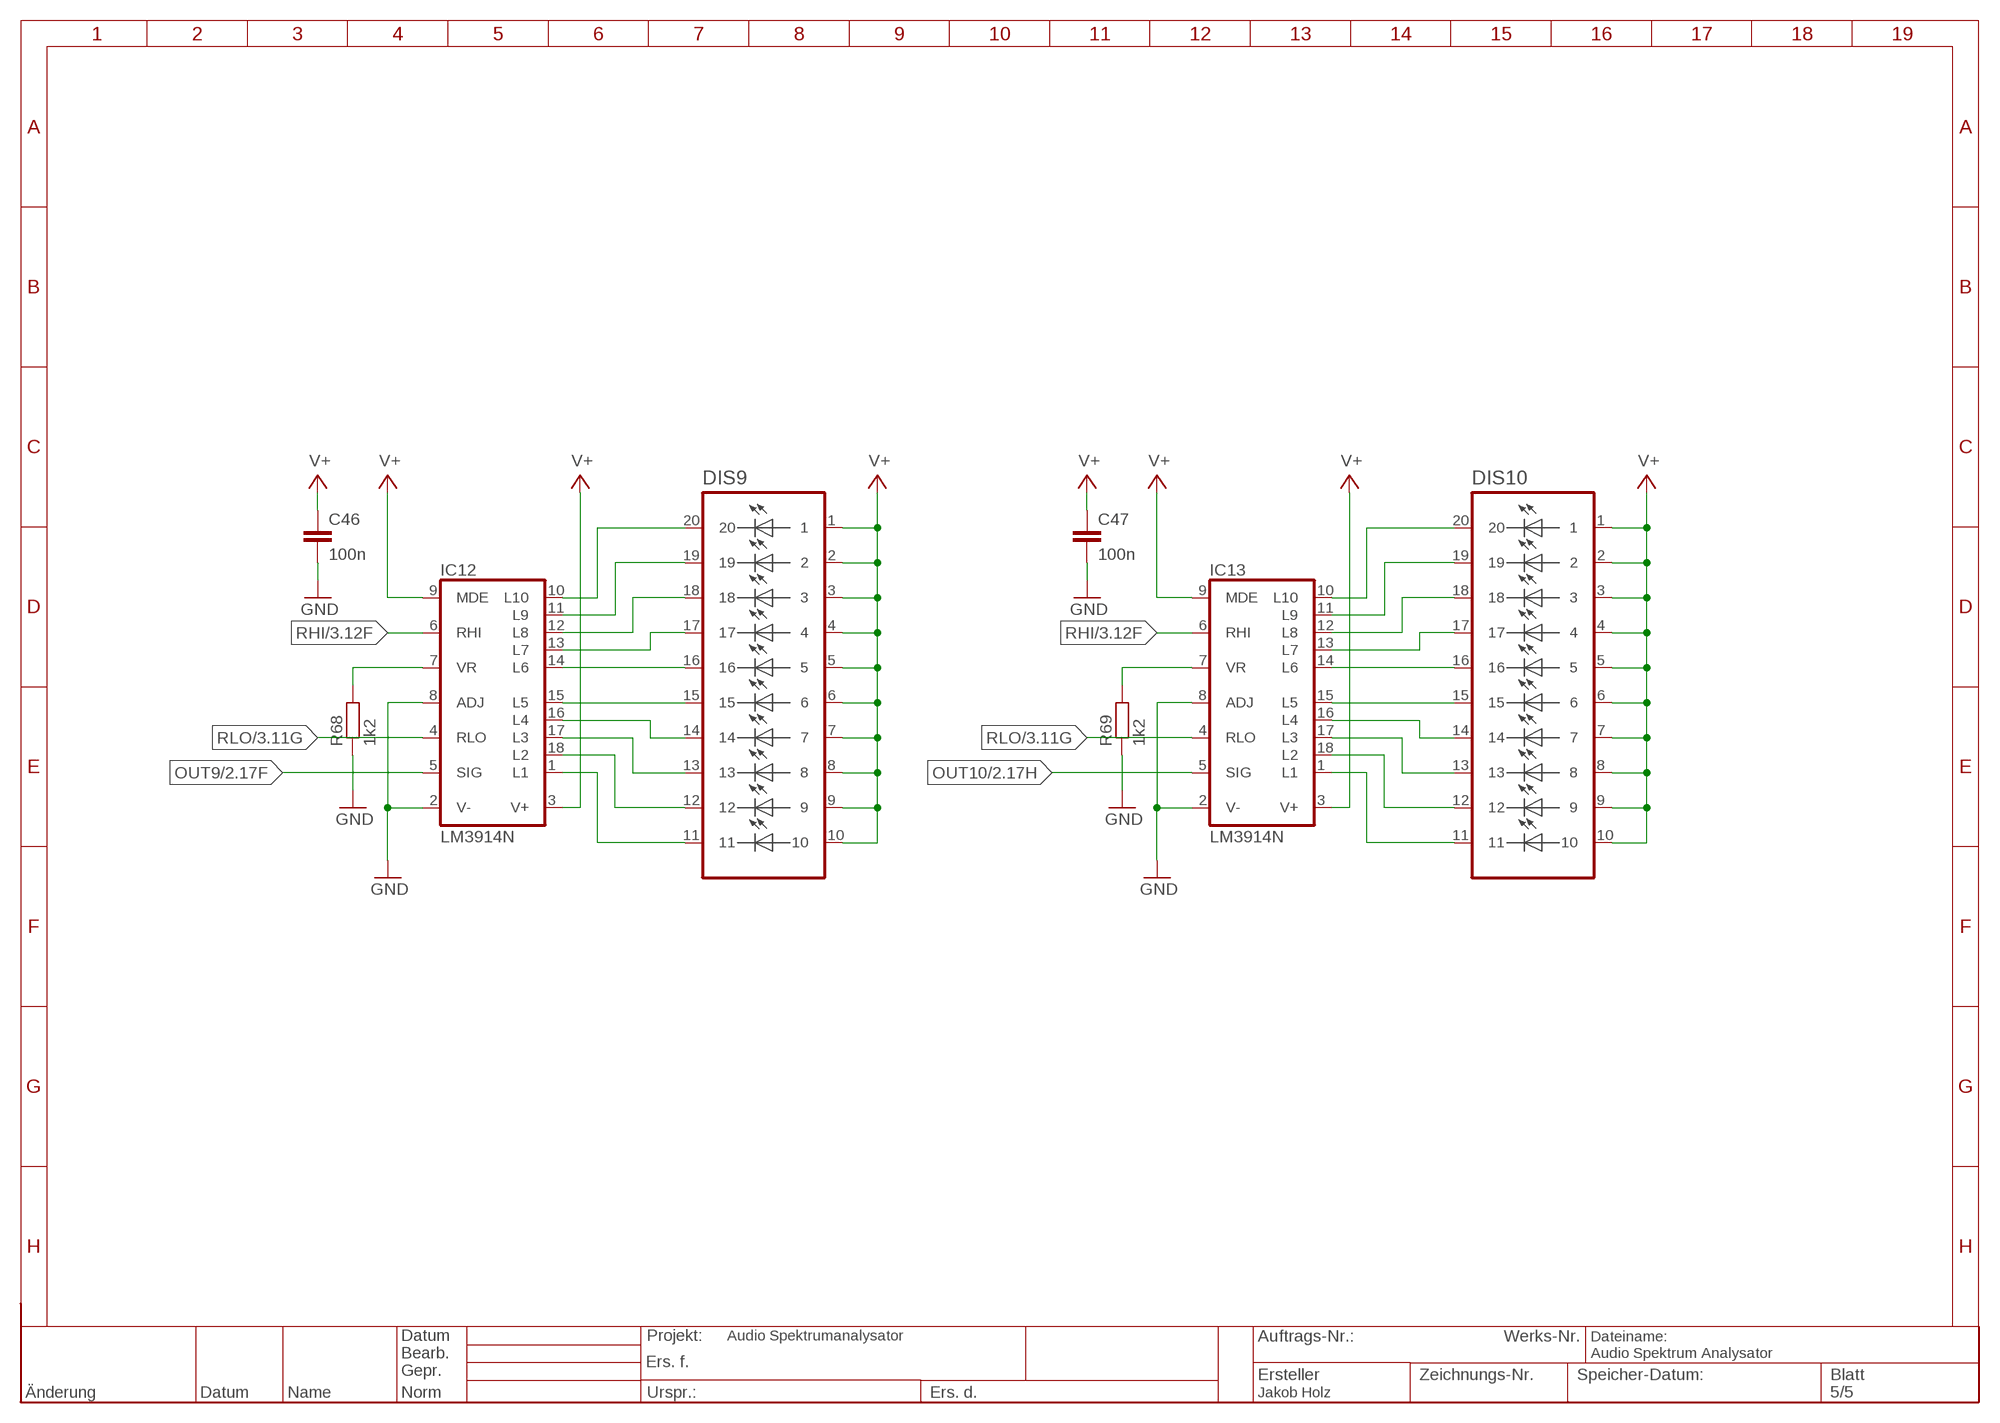
[diagram p4: schematic, sheet 5]

### Parts
C46  100n  C-EU050-024X044  [C050-024X044]
C47  100n  C-EU050-024X044  [C050-024X044]
DIS9  SHB10R  [SHB10R]
DIS10  SHB10R  [SHB10R]
IC12  LM3914N  [DIL18]
IC13  LM3914N  [DIL18]
R68  1k2  R-EU_0207/7  [0207/7]
R69  1k2  R-EU_0207/7  [0207/7]

### Nets
GND: C46.2 C47.2 IC12.2(V-) IC12.8(ADJ) IC13.2(V-) IC13.8(ADJ) R68.1 R69.1 ; also sheet 1,2,3,4
N$14: DIS9.15 IC12.15(L5)
N$15: DIS9.14 IC12.16(L4)
N$16: DIS9.13 IC12.17(L3)
N$20: DIS9.12 IC12.18(L2)
N$21: DIS9.11 IC12.1(L1)
N$22: DIS9.16 IC12.14(L6)
N$23: DIS9.17 IC12.13(L7)
N$24: DIS9.18 IC12.12(L8)
N$25: DIS9.19 IC12.11(L9)
N$69: IC12.7(VR) R68.2
N$81: IC13.7(VR) R69.2
N$126: DIS9.20 IC12.10(L10)
N$131: DIS10.15 IC13.15(L5)
N$132: DIS10.14 IC13.16(L4)
N$171: DIS10.13 IC13.17(L3)
N$172: DIS10.12 IC13.18(L2)
N$173: DIS10.11 IC13.1(L1)
N$174: DIS10.16 IC13.14(L6)
N$175: DIS10.17 IC13.13(L7)
N$176: DIS10.18 IC13.12(L8)
N$177: DIS10.19 IC13.11(L9)
N$178: DIS10.20 IC13.10(L10)
OUT9: IC12.5(SIG) ; also sheet 2
OUT10: IC13.5(SIG) ; also sheet 2
RHI: IC12.6(RHI) IC13.6(RHI) ; also sheet 3,4
RLO: IC12.4(RLO) IC13.4(RLO) ; also sheet 3,4
V+ [V+]: C46.1 C47.1 DIS9.1 DIS9.2 DIS9.3 DIS9.4 DIS9.5 DIS9.6 DIS9.7 DIS9.8 DIS9.9 DIS9.10 DIS10.1 DIS10.2 DIS10.3 DIS10.4 DIS10.5 DIS10.6 DIS10.7 DIS10.8 DIS10.9 DIS10.10 IC12.3(V+) IC12.9(MDE) IC13.3(V+) IC13.9(MDE) ; also sheet 1,3,4

## Library data of the parts
C1-C4 C12 C13 C22-C25 C34-C37 = resistor:CPOL-EU: POLARIZED CAPACITOR, European symbol
C5-C11 C14-C21 C26-C33 C38-C47 = resistor:C-EU: CAPACITOR, European symbol
D1-D11 = diode:1N4148: DIODE high speed (Philips)
DIS1-DIS10 = Jakobs_LBR:SHB10R: The SHB10R is a 10 segment led graph display.
IC1-IC3 = linear:LM324: OP AMP
IC4-IC13 = linear:LM3914N: LED DRIVER senses analog voltage levels and drives 10 LEDs
J1 = Jakobs_LBR:2.5MM-AUX
J2 = con-jack:DCJ0202: DC POWER JACK Source: DCJ0202.pdf; OC_FARNELL: unknown; OC_NEWARK: unknown
Q1 = adafruit:ELECTRET: Electret microphone Thru hole 2.54mm spacing with 9.7mm diameter
R1-R3 R6-R12 R14 R22 R23 R36-R39 R52-R55 = rcl:R-EU_: RESISTOR, European symbol; SPICEPREFIX: R
R4 R5 = resistor:R-TRIMM: Trimm resistor
R13 R15-R21 R24-R35 R40-R51 R56-R69 = resistor:R-EU_: RESISTOR, European symbol
S1 = Jakobs_LBR:SPDT
TP1-TP5 = testpad:TP: Test pad

## Net classes
0 default: width 0.406 mm
1 V+: width 0.813 mm

## Board
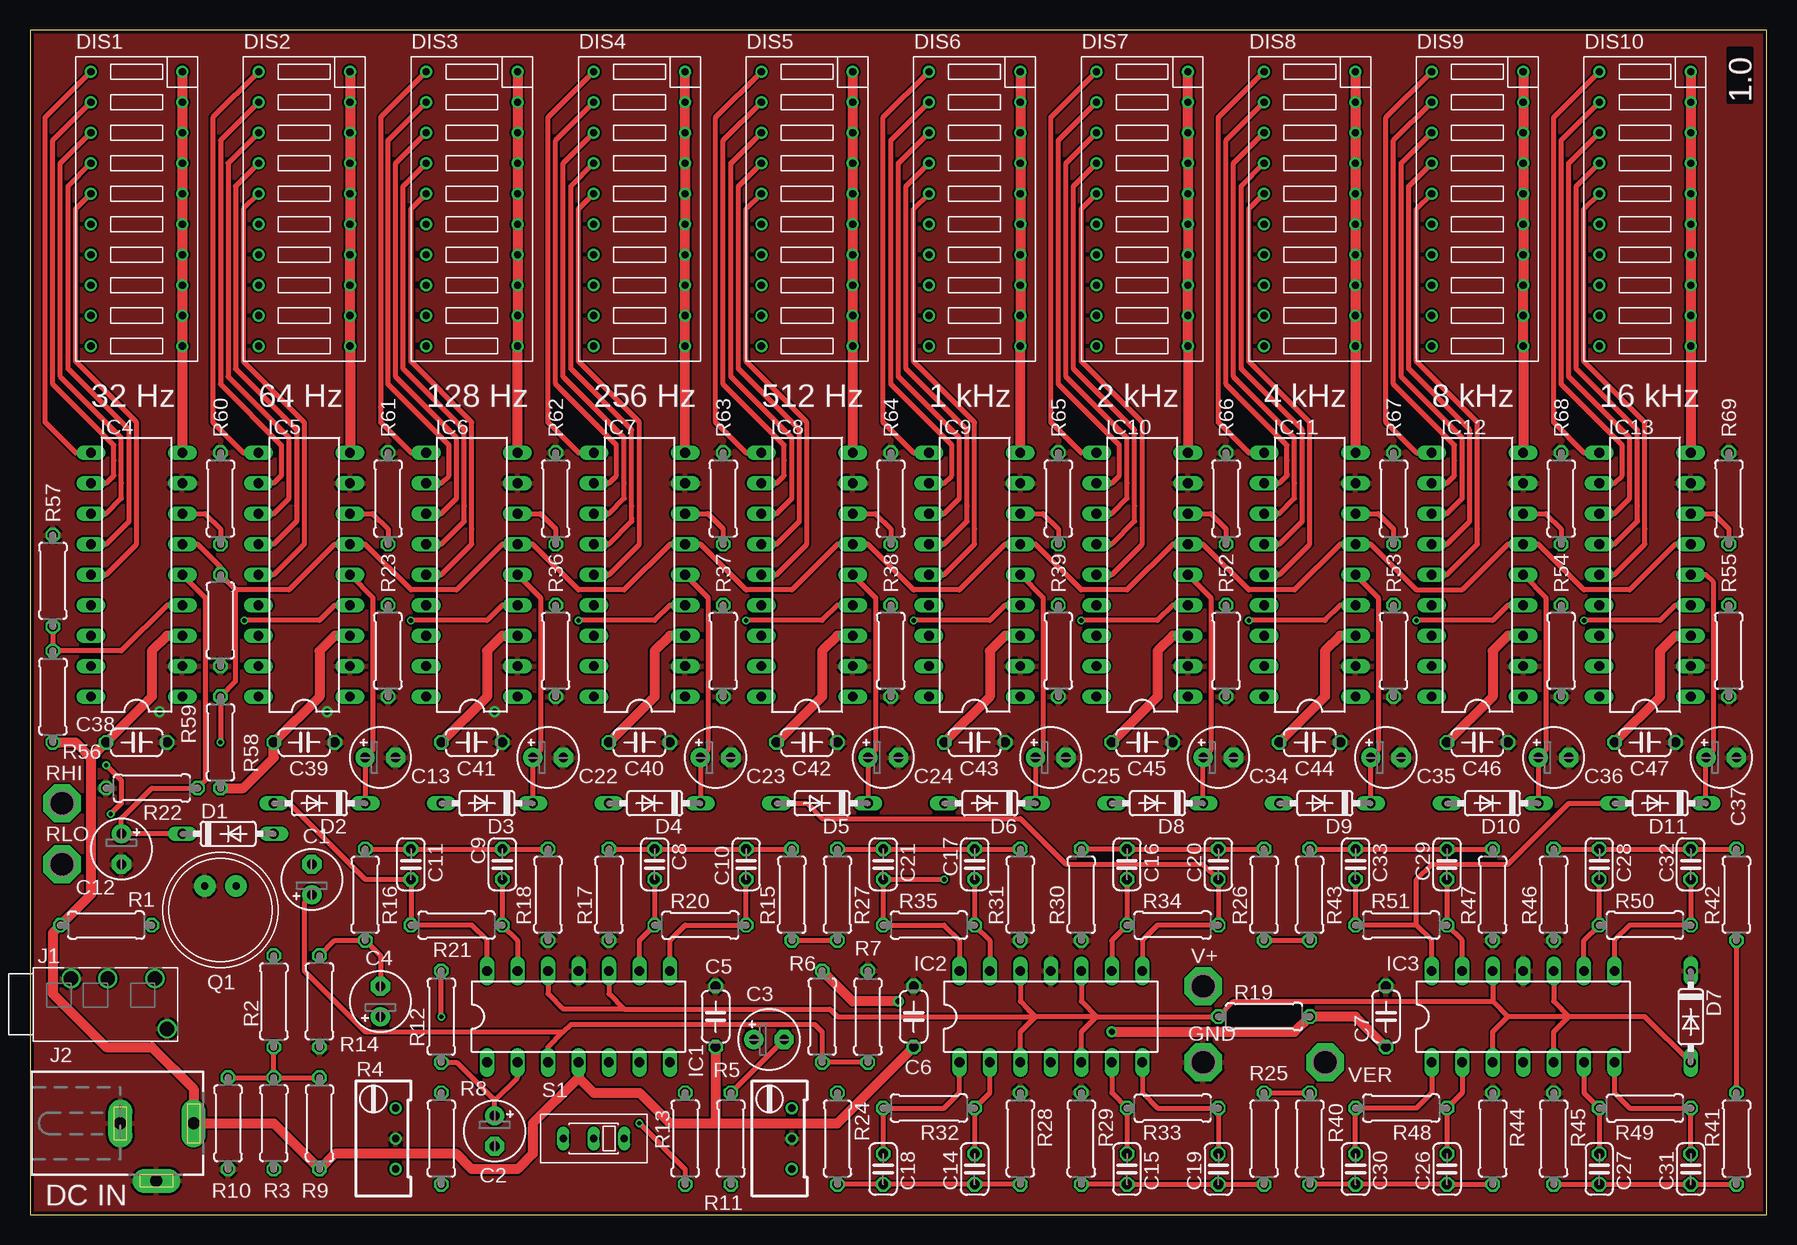
[diagram p5: board, top side]
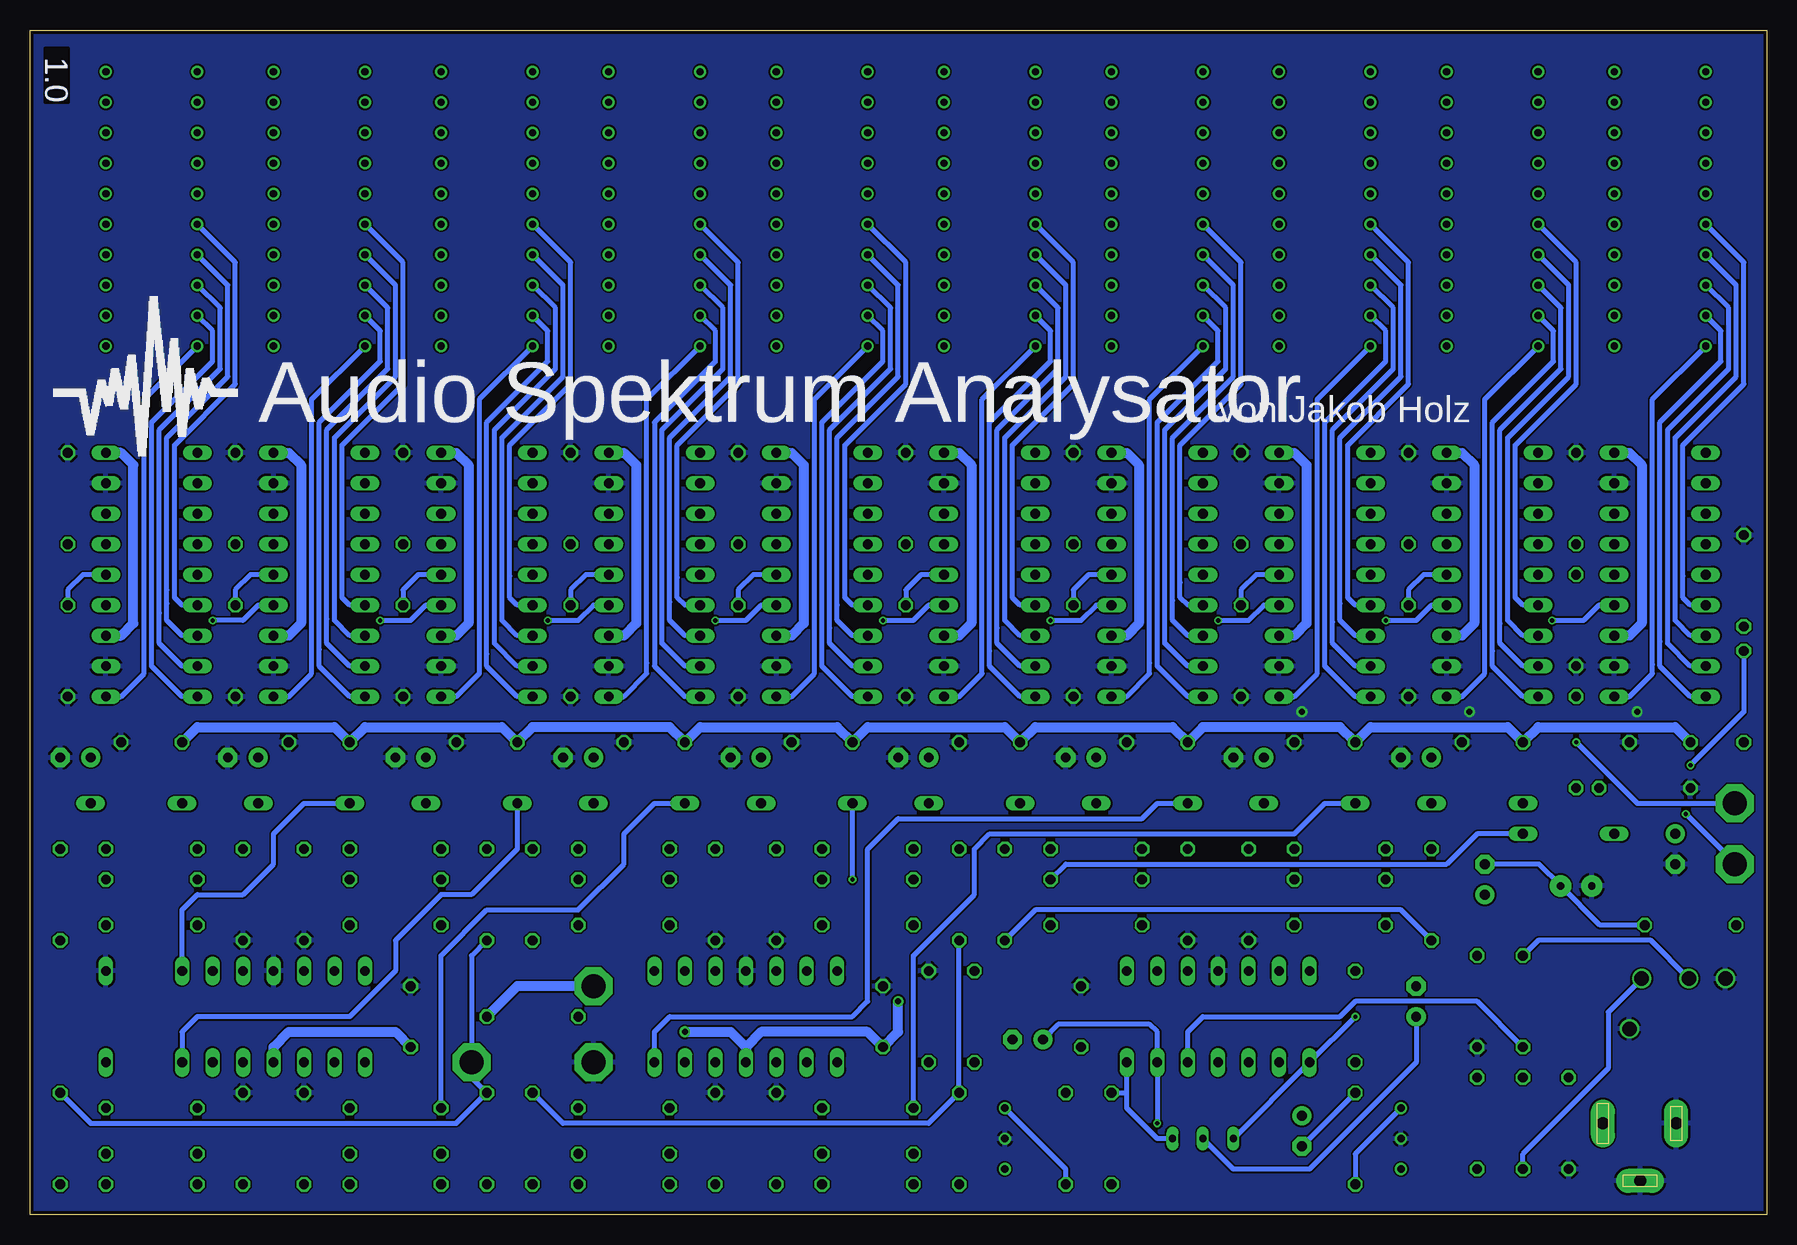
[diagram p6: board, bottom side, seen from below]

Size 144.76 x 98.73 mm. Coordinates in mm from the lower left corner, seen from the top.
Outline: 0,0 144.76,0 144.76,98.73 0,98.73 0,0
Copper layers (1*16): Top 0.035mm / dielectric 1.5mm / Bottom 0.035mm
Design rules "PCB-POOL Standard *": minimum track width 0.15mm, minimum drill 0.3mm, track to track 0.15mm, track to pad 0.15mm, pad to pad 0.15mm, via to via 0.15mm, smd to smd 0.15mm, copper to edge 0.3mm, drill to drill 0.2mm, minimum pad ring 0.2mm, minimum via ring 0.15mm, stop-mask expansion 0.075mm, vias tented up to drill 0mil, thermal gap 0.2mm

### Footprints (pad centres in the part's own frame; a part is rotated, then mirrored left to right if it is on the bottom)
E2,5-5 = drill 0.813 pad 1.6: + -1.27,0 | drill 0.813 pad 1.6 octagon: - 1.27,0
C050-024X044 = drill 0.813 octagon: 1 -2.54,0; 2 2.54,0
C025-024X044 = drill 0.813 octagon: 1 -1.27,0; 2 1.27,0
DO35-7 = drill 0.813 long: A 3.81,0; C -3.81,0
SHB10R = drill 0.6: 1 8.89,24.13; 2 8.89,21.59; 3 8.89,19.05; 4 8.89,16.51; 5 8.89,13.97; 6 8.89,11.43; 7 8.89,8.89; 8 8.89,6.35; 9 8.89,3.81; 10 8.89,1.27; 11 1.27,1.27; 12 1.27,3.81; 13 1.27,6.35; 14 1.27,8.89; 15 1.27,11.43; 16 1.27,13.97; 17 1.27,16.51; 18 1.27,19.05; 19 1.27,21.59; 20 1.27,24.13
DIL14 = drill 0.813 long: 1 -7.62,-3.81; 2 -5.08,-3.81; 3 -2.54,-3.81; 4 0,-3.81; 5 2.54,-3.81; 6 5.08,-3.81; 7 7.62,-3.81; 8 7.62,3.81; 9 5.08,3.81; 10 2.54,3.81; 11 0,3.81; 12 -2.54,3.81; 13 -5.08,3.81; 14 -7.62,3.81
DIL18 = drill 0.813 long: 1 -10.16,-3.81; 2 -7.62,-3.81; 3 -5.08,-3.81; 4 -2.54,-3.81; 5 0,-3.81; 6 2.54,-3.81; 7 5.08,-3.81; 8 7.62,-3.81; 9 10.16,-3.81; 10 10.16,3.81; 11 7.62,3.81; 12 5.08,3.81; 13 2.54,3.81; 14 0,3.81; 15 -2.54,3.81; 16 -5.08,3.81; 17 -7.62,3.81; 18 -10.16,3.81
2,5MM-AUX_JACK = drill 1.2: 1 -2.286,2.54; 2 0.762,2.54; 3 4.699,2.54; 4 5.715,-1.651
DCJ0202 = drill 1 pad 2 long: 1 0,3.1; 2 4.8,0; 3 0,-3
9.7ELECTRET = drill 0.6 pad 1.778: + 1.3,2; - -1.3,2
0207/7 = drill 0.813 octagon: 1 -3.81,0; 2 3.81,0
RTRIM64W = drill 0.61: 1 1.27,-2.54; 2 1.27,0; 3 1.27,2.54
SPDT = drill 0.6 long: 1 -2.54,0; 2 0,0; 3 2.54,0
P1-20 = drill 2.007 pad 3.15 octagon: TP 0,0

### Placement (x,y rotation side)
C1  23.5,27.94 90 top
C2  38.73,6.99 270 top
C3  61.59,14.61 0 top
C4  29.21,17.78 90 top
C5  57.15,16.51 90 top
C6  73.66,16.51 90 top
C7  113.03,16.51 90 top
C8  52.07,29.21 270 top
C9  39.37,29.21 270 top
C10  59.69,29.21 270 top
C11  31.75,29.21 270 top
C12  7.62,30.48 270 top
C13  29.21,38.1 0 top
C14  78.74,3.81 90 top
C15  91.44,3.81 90 top
C16  91.44,29.21 270 top
C17  78.74,29.21 270 top
C18  71.12,3.81 90 top
C19  99.06,3.81 90 top
C20  99.06,29.21 270 top
C21  71.12,29.21 270 top
C22  43.18,38.1 0 top
C23  57.15,38.1 0 top
C24  71.12,38.1 0 top
C25  85.09,38.1 0 top
C26  118.11,3.81 90 top
C27  130.81,3.81 90 top
C28  130.81,29.21 270 top
C29  118.11,29.21 270 top
C30  110.49,3.81 90 top
C31  138.43,3.81 90 top
C32  138.43,29.21 270 top
C33  110.49,29.21 270 top
C34  99.06,38.1 0 top
C35  113.03,38.1 0 top
C36  127,38.1 0 top
C37  140.97,38.1 0 top
C38  8.89,39.37 0 top
C39  22.86,39.37 0 top
C40  50.8,39.37 0 top
C41  36.83,39.37 0 top
C42  64.77,39.37 0 top
C43  78.74,39.37 0 top
C44  106.68,39.37 0 top
C45  92.71,39.37 0 top
C46  120.65,39.37 0 top
C47  134.62,39.37 0 top
D1  16.51,31.75 0 top
D2  24.13,34.29 180 top
D3  38.1,34.29 180 top
D4  52.07,34.29 180 top
D5  66.04,34.29 180 top
D6  80.01,34.29 180 top
D7  138.43,16.51 270 top
D8  93.98,34.29 180 top
D9  107.95,34.29 180 top
D10  121.92,34.29 180 top
D11  135.89,34.29 180 top
DIS1  3.81,71.12 0 top
DIS2  17.78,71.12 0 top
DIS3  31.75,71.12 0 top
DIS4  45.72,71.12 0 top
DIS5  59.69,71.12 0 top
DIS6  73.66,71.12 0 top
DIS7  87.63,71.12 0 top
DIS8  101.6,71.12 0 top
DIS9  115.57,71.12 0 top
DIS10  129.54,71.12 0 top
IC1  45.72,16.51 0 top
IC2  85.09,16.51 0 top
IC3  124.46,16.51 0 top
IC4  8.89,53.34 90 top
IC5  22.86,53.34 90 top
IC6  36.83,53.34 90 top
IC7  50.8,53.34 90 top
IC8  64.77,53.34 90 top
IC9  78.74,53.34 90 top
IC10  92.71,53.34 90 top
IC11  106.68,53.34 90 top
IC12  120.65,53.34 90 top
IC13  134.62,53.34 90 top
J1  5.71,17.14 0 top
J2  10.54,7.62 270 top
Q1  15.88,25.4 0 top
R1  6.35,24.13 180 top
R2  20.32,17.78 270 top
R3  20.32,7.62 90 top
R4  29.21,6.35 0 top
R5  62.23,6.35 0 top
R6  66.04,16.51 90 top
R7  69.85,16.51 270 top
R8  34.29,6.35 90 top
R9  24.13,7.62 270 top
R10  16.51,7.62 90 top
R11  58.42,6.35 90 top
R12  34.29,16.51 90 top
R13  54.61,6.35 90 top
R14  24.13,17.78 90 top
R15  63.5,26.67 90 top
R16  27.94,26.67 90 top
R17  48.26,26.67 90 top
R18  43.18,26.67 90 top
R19  102.87,16.51 0 top
R20  55.88,24.13 0 top
R21  35.56,24.13 180 top
R22  10.16,35.56 0 top
R23  29.84,46.99 90 top
R24  67.31,6.35 270 top
R25  102.87,6.35 270 top
R26  102.87,26.67 90 top
R27  67.31,26.67 90 top
R28  82.55,6.35 270 top
R29  87.63,6.35 270 top
R30  87.63,26.67 90 top
R31  82.55,26.67 90 top
R32  74.93,8.89 180 top
R33  95.25,8.89 0 top
R34  95.25,24.13 0 top
R35  74.93,24.13 180 top
R36  43.81,46.99 90 top
R37  57.78,46.99 90 top
R38  71.75,46.99 90 top
R39  85.72,46.99 90 top
R40  106.68,6.35 270 top
R41  142.24,6.35 270 top
R42  142.24,26.67 90 top
R43  106.68,26.67 90 top
R44  121.92,6.35 270 top
R45  127,6.35 270 top
R46  127,26.67 90 top
R47  121.92,26.67 90 top
R48  114.3,8.89 180 top
R49  134.62,8.89 0 top
R50  134.62,24.13 0 top
R51  114.3,24.13 180 top
R52  99.69,46.99 90 top
R53  113.67,46.99 90 top
R54  127.64,46.99 90 top
R55  141.6,46.99 90 top
R56  1.91,43.18 270 top
R57  1.91,52.83 270 top
R58  15.88,39.37 270 top
R59  15.88,49.53 90 top
R60  15.88,59.69 270 top
R61  29.84,59.69 270 top
R62  43.81,59.69 270 top
R63  57.78,59.69 270 top
R64  71.75,59.69 270 top
R65  85.72,59.69 270 top
R66  99.69,59.69 270 top
R67  113.67,59.69 270 top
R68  127.64,59.69 270 top
R69  141.6,59.69 270 top
S1  46.99,6.35 0 top
TP1  97.79,19.05 0 top
TP2  97.79,12.7 0 top
TP3  107.95,12.7 0 top
TP4  2.67,34.29 0 top
TP5  2.67,29.21 0 top

### Tracks (layer width: path | path; a pad name or v marks a point on that pad's centre or on a via)
GND  (via drill 0.5)
  other vias: 24.77,41.91 10.79,41.91 38.73,41.91
  pour Bottom: -2.54,101.6 147.32,101.6 147.32,-2.54 -2.54,-2.54
  pour Top: -1.27,100.33 146.05,100.33 146.05,-1.27 -1.27,-1.27
N$1
  Bottom 0.406: R2.1 19.05,22.86 9.65,22.86 J1.2
N$2
  Bottom 0.406: R3.1 20.32,5.08 13.21,12.19 13.21,16.89 J1.3
N$3
  Top 0.406: R3.2 R2.2 | R10.2 R3.2 | R3.2 R9.1
  Bottom 0.406: IC1.5 48.26,15.24 46.99,16.51 35.56,16.51 34.29,17.78 24.13,17.78 R2.2
N$4
  Top 0.406: IC1.3 43.18,13.97 44.45,15.24 | 44.45,15.24 45.09,15.88 65.41,15.88 66.04,15.24 R6.1 R7.2 | 44.45,15.24 27.94,15.24 22.86,20.32 22.86,26.04 C1.+
N$5
  Top 0.406: IC1.2 40.64,11.43 38.73,9.53 | C2.+ 38.73,9.53 | R12.1 35.56,12.7 38.73,9.53
N$6  (via drill 0.35)
  Top 0.406: v34.29,16.51 R12.2
  Bottom 0.406: S1.1 IC1.1 v34.29,16.51
N$7
  Bottom 0.406: IC6.15 34.29,50.8 34.92,51.44 34.92,52.96 34.92,64.14 29.84,69.22 29.84,79.38 DIS3.15
N$8
  Bottom 0.406: IC6.16 34.29,48.26 35.56,49.53 35.56,50.93 35.56,64.77 30.48,69.85 30.48,77.47 DIS3.14
N$9
  Bottom 0.406: IC6.17 34.29,45.72 36.2,47.62 36.2,49.4 36.2,65.41 31.11,70.48 31.11,75.56 DIS3.13
N$10
  Bottom 0.406: S1.3 50.8,6.35 53.34,8.89 53.34,10.16 | 53.34,10.16 IC1.7 | R13.2 53.34,10.16
N$11
  Bottom 0.406: IC6.18 34.29,43.18 36.83,45.72 36.83,47.12 36.83,66.04 31.75,71.12 31.75,73.66 DIS3.12
N$12
  Bottom 0.406: S1.2 44.45,3.81 38.1,3.81 29.21,12.7 C4.+
N$13
  Bottom 0.406: R1.1 13.9,24.13 Q1.+ 18.98,29.21 C1.-
N$14
  Bottom 0.406: IC12.15 118.11,50.8 118.75,51.44 118.75,64.14 113.67,69.22 113.67,79.38 DIS9.15
N$15
  Bottom 0.406: IC12.16 118.11,48.26 119.38,49.53 119.38,51.69 119.38,64.77 114.3,69.85 114.3,77.47 DIS9.14
N$16
  Bottom 0.406: IC12.17 118.11,45.72 120.02,47.62 120.02,49.66 120.02,65.41 114.94,70.48 114.94,75.56 DIS9.13
N$17
  Bottom 0.406: IC6.1 39.37,43.18 37.47,45.09 37.47,45.59 37.47,67.94 DIS3.11
N$18
  Top 0.406: IC6.14 34.29,53.34 36.83,55.88 36.83,57.15 36.83,66.04 31.75,71.12 31.75,83.82 DIS3.16
N$19
  Top 0.406: IC6.13 34.29,55.88 36.2,57.78 36.2,59.05 36.2,65.41 31.11,70.48 31.11,85.72 DIS3.17
N$20
  Bottom 0.406: IC12.18 118.11,43.18 120.65,45.72 120.65,47.12 120.65,66.04 115.57,71.12 115.57,73.66 DIS9.12
N$21
  Bottom 0.406: IC12.1 123.19,43.18 121.28,45.09 121.28,45.47 121.28,67.94 DIS9.11
N$22
  Top 0.406: IC12.14 118.11,53.34 120.65,55.88 120.65,57.15 120.65,66.04 115.57,71.12 115.57,83.82 DIS9.16
N$23
  Top 0.406: IC12.13 118.11,55.88 120.02,57.78 120.02,59.05 120.02,65.41 114.94,70.48 114.94,85.72 DIS9.17
N$24
  Top 0.406: IC12.12 118.11,58.42 119.38,59.69 119.38,60.96 119.38,64.77 114.3,69.85 114.3,87.63 DIS9.18
N$25
  Top 0.406: IC12.11 118.11,60.96 118.75,61.59 118.75,62.87 118.75,64.14 113.67,69.22 113.67,89.53 DIS9.19
N$26
  Top 0.406: IC6.12 34.29,58.42 35.56,59.69 35.56,60.96 35.56,64.77 30.48,69.85 30.48,87.63 DIS3.18
N$27
  Top 0.406: IC6.11 34.29,60.96 34.92,61.59 34.92,62.87 34.92,64.14 29.84,69.22 29.84,89.53 DIS3.19
N$28
  Top 0.406: DIS3.20 29.21,91.44 29.21,67.31 29.21,66.04 31.75,63.5 IC6.10
N$29
  Top 0.406: IC6.7 42.55,58.42 43.81,57.15 R62.2
N$30
  Top 0.406: IC5.7 28.57,58.42 29.84,57.15 R61.2
N$31
  Bottom 0.406: R8.2 C2.-
N$32
  Bottom 0.406: IC5.15 20.32,50.8 20.95,51.44 20.95,52.58 20.95,64.14 15.88,69.22 15.88,79.38 DIS2.15
N$33
  Bottom 0.406: IC5.16 20.32,48.26 21.59,49.53 21.59,51.18 21.59,64.77 16.51,69.85 16.51,77.47 DIS2.14
N$34
  Bottom 0.406: IC5.17 20.32,45.72 22.23,47.62 22.23,49.28 22.23,65.41 17.14,70.48 17.14,75.56 DIS2.13
N$35
  Bottom 0.406: IC5.18 20.32,43.18 22.86,45.72 22.86,46.99 22.86,66.04 17.78,71.12 17.78,73.66 DIS2.12
N$36
  Bottom 0.406: IC5.1 25.4,43.18 23.5,45.09 23.5,45.59 23.5,67.94 DIS2.11
N$37
  Top 0.406: DIS2.16 17.78,83.82 17.78,71.12 22.86,66.04 22.86,57.15 22.86,55.88 20.32,53.34 IC5.14
N$38
  Top 0.406: DIS2.17 17.14,85.72 17.14,70.48 22.23,65.41 22.23,59.05 22.23,57.78 20.32,55.88 IC5.13
N$39
  Top 0.406: DIS2.18 16.51,87.63 16.51,69.85 21.59,64.77 21.59,60.96 21.59,59.69 20.32,58.42 IC5.12
N$40
  Top 0.406: DIS2.19 15.88,89.53 15.88,69.22 20.95,64.14 20.95,62.87 20.95,61.59 20.32,60.96 IC5.11
N$41
  Top 0.406: DIS2.20 15.24,91.44 15.24,67.31 15.24,66.04 17.78,63.5 IC5.10
N$42
  Top 0.406: IC7.7 56.52,58.42 57.78,57.15 R63.2
N$43
  Top 0.406: IC8.7 70.48,58.42 71.75,57.15 R64.2
N$44
  Bottom 0.406: R4.3 34.29,5.08 R8.1
N$45
  Bottom 0.406: IC7.15 48.26,50.8 48.9,51.44 48.9,52.7 48.9,64.14 43.81,69.22 43.81,79.38 DIS4.15
N$46
  Bottom 0.406: IC7.16 48.26,48.26 49.53,49.53 49.53,51.18 49.53,64.77 44.45,69.85 44.45,77.47 DIS4.14
N$47
  Bottom 0.406: IC7.17 48.26,45.72 50.16,47.62 50.16,49.53 50.16,65.41 45.09,70.48 45.09,75.56 DIS4.13
N$48
  Bottom 0.406: IC7.18 48.26,43.18 50.8,45.72 50.8,46.99 50.8,66.04 45.72,71.12 45.72,73.66 DIS4.12
N$49
  Bottom 0.406: IC7.1 53.34,43.18 51.44,45.09 51.44,45.97 51.44,67.94 DIS4.11
N$50
  Top 0.406: IC7.14 48.26,53.34 50.8,55.88 50.8,57.15 50.8,66.04 45.72,71.12 45.72,83.82 DIS4.16
N$51
  Top 0.406: IC7.13 48.26,55.88 50.16,57.78 50.16,58.04 50.16,59.05 50.16,65.41 45.09,70.48 45.09,85.72 DIS4.17
N$52
  Top 0.406: IC7.12 48.26,58.42 49.53,59.69 49.53,60.96 49.53,64.77 44.45,69.85 44.45,87.63 DIS4.18
N$53
  Top 0.406: IC7.11 48.26,60.96 48.9,61.59 48.9,64.14 43.81,69.22 43.81,89.53 DIS4.19
N$54
  Top 0.406: IC7.10 45.72,63.5 43.18,66.04 43.18,67.31 43.18,91.44 DIS4.20
N$55
  Top 0.406: IC10.7 98.42,58.42 99.69,57.15 R66.2
N$56
  Top 0.406: IC9.7 84.45,58.42 85.72,57.15 R65.2
N$57  (via drill 0.35)
  Top 0.406: v50.8,7.62 54.61,3.81 R13.1
  Bottom 0.406: v50.8,7.62 IC1.6 50.8,15.24 51.44,15.88 59.05,15.88 C3.+
N$58
  Bottom 0.406: IC8.15 62.23,50.8 62.87,51.44 62.87,52.7 62.87,64.14 57.78,69.22 57.78,79.38 DIS5.15
N$59
  Bottom 0.406: IC8.16 62.23,48.26 63.5,49.53 63.5,50.8 63.5,64.77 58.42,69.85 58.42,77.47 DIS5.14
N$60
  Bottom 0.406: IC8.17 62.23,45.72 64.14,47.62 64.14,48.9 64.14,65.41 59.05,70.48 59.05,75.56 DIS5.13
N$61
  Bottom 0.406: IC8.18 62.23,43.18 64.77,45.72 64.77,46.99 64.77,66.04 59.69,71.12 59.69,73.66 DIS5.12
N$62
  Bottom 0.406: IC8.1 67.31,43.18 65.41,45.09 65.41,67.94 DIS5.11
N$63
  Top 0.406: IC8.14 62.23,53.34 64.77,55.88 64.77,57.15 64.77,66.04 59.69,71.12 59.69,83.82 DIS5.16
N$64
  Top 0.406: IC8.13 62.23,55.88 64.14,57.78 64.14,59.05 64.14,65.41 59.05,70.48 59.05,85.72 DIS5.17
N$65
  Top 0.406: IC8.12 62.23,58.42 63.5,59.69 63.5,60.96 63.5,64.77 58.42,69.85 58.42,87.63 DIS5.18
N$66
  Top 0.406: IC8.11 62.23,60.96 62.87,61.59 62.87,62.87 62.87,64.14 57.78,69.22 57.78,89.53 DIS5.19
N$67
  Top 0.406: IC8.10 59.69,63.5 57.15,66.04 57.15,67.31 57.15,91.44 DIS5.20
N$68
  Top 0.406: IC11.7 112.39,58.42 113.67,57.15 R67.2
N$69
  Top 0.406: IC12.7 126.36,58.42 127.64,57.15 R68.2
N$70
  Top 0.406: R11.2 C3.-
N$71
  Bottom 0.406: IC10.15 90.17,50.8 90.81,51.44 90.81,53.09 90.81,64.14 85.72,69.22 85.72,79.38 DIS7.15
N$72
  Bottom 0.406: IC10.16 90.17,48.26 91.44,49.53 91.44,51.05 91.44,64.77 86.36,69.85 86.36,77.47 DIS7.14
N$73
  Bottom 0.406: IC10.17 90.17,45.72 92.08,47.62 92.08,48.9 92.08,65.41 87,70.48 87,75.56 DIS7.13
N$74
  Bottom 0.406: DIS7.12 87.63,73.66 87.63,71.12 92.71,66.04 92.71,45.72 90.17,43.18 IC10.18
N$75
  Bottom 0.406: IC10.1 95.25,43.18 93.34,45.09 93.34,45.97 93.34,67.94 DIS7.11
N$76
  Top 0.406: IC10.14 90.17,53.34 92.71,55.88 92.71,57.15 92.71,66.04 87.63,71.12 87.63,83.82 DIS7.16
N$77
  Top 0.406: IC10.13 90.17,55.88 92.08,57.78 92.08,59.05 92.08,65.41 87,70.48 87,85.72 DIS7.17
N$78
  Top 0.406: IC10.12 90.17,58.42 91.44,59.69 91.44,60.96 91.44,64.77 86.36,69.85 86.36,87.63 DIS7.18
N$79
  Top 0.406: IC10.11 90.17,60.96 90.81,61.59 90.81,61.72 90.81,62.87 90.81,64.14 85.72,69.22 85.72,89.53 DIS7.19
N$80
  Top 0.406: IC10.10 87.63,63.5 85.09,66.04 85.09,67.31 85.09,91.44 DIS7.20
N$81
  Top 0.406: IC13.7 140.34,58.42 141.6,57.15 R69.2
N$83
  Bottom 0.406: R11.1 58.42,3.81 R5.3
N$84
  Bottom 0.406: IC9.15 76.2,50.8 76.83,51.44 76.83,52.7 76.83,64.14 71.75,69.22 71.75,79.38 DIS6.15
N$85
  Bottom 0.406: IC9.16 76.2,48.26 77.47,49.53 77.47,50.8 77.47,64.77 72.39,69.85 72.39,77.47 DIS6.14
N$86
  Bottom 0.406: IC9.17 76.2,45.72 78.11,47.62 78.11,48.9 78.11,65.41 73.03,70.48 73.03,75.56 DIS6.13
N$87
  Bottom 0.406: IC9.18 76.2,43.18 78.74,45.72 78.74,46.99 78.74,66.04 73.66,71.12 73.66,73.66 DIS6.12
N$88
  Bottom 0.406: IC9.1 81.28,43.18 79.38,45.09 79.38,67.94 DIS6.11
N$89
  Top 0.406: IC9.14 76.2,53.34 78.74,55.88 78.74,57.15 78.74,66.04 73.66,71.12 73.66,83.82 DIS6.16
N$90
  Top 0.406: IC9.13 76.2,55.88 78.11,57.78 78.11,59.05 78.11,65.41 73.03,70.48 73.03,85.72 DIS6.17
N$91
  Top 0.406: IC9.12 76.2,58.42 77.47,59.69 77.47,60.96 77.47,64.77 72.39,69.85 72.39,87.63 DIS6.18
N$92
  Top 0.406: IC9.11 76.2,60.96 76.83,61.59 76.83,62.87 76.83,64.14 71.75,69.22 71.75,89.53 DIS6.19
N$93
  Top 0.406: IC9.10 73.66,63.5 71.12,66.04 71.12,67.31 71.12,91.44 DIS6.20
N$97
  Bottom 0.406: IC4.15 6.35,50.8 6.99,51.44 6.99,53.21 6.99,64.14 1.91,69.22 1.91,79.38 DIS1.15
N$98
  Bottom 0.406: IC4.16 6.35,48.26 7.62,49.53 7.62,51.44 7.62,64.77 2.54,69.85 2.54,77.47 DIS1.14
N$99
  Bottom 0.406: IC4.17 6.35,45.72 8.26,47.62 8.26,49.15 8.26,65.41 3.17,70.48 3.17,75.56 DIS1.13
N$100
  Bottom 0.406: IC4.18 6.35,43.18 8.89,45.72 8.89,47.75 8.89,66.04 3.81,71.12 3.81,73.66 DIS1.12
N$101
  Bottom 0.406: IC4.1 11.43,43.18 9.53,45.09 9.53,45.85 9.53,67.94 DIS1.11
N$102
  Top 0.406: IC4.14 6.35,53.34 8.89,55.88 8.89,57.15 8.89,66.04 3.81,71.12 3.81,83.82 DIS1.16
N$103
  Top 0.406: IC4.13 6.35,55.88 8.26,57.78 8.26,59.05 8.26,65.41 3.17,70.48 3.17,85.72 DIS1.17
N$104
  Top 0.406: IC4.12 6.35,58.42 7.62,59.69 7.62,60.96 7.62,64.77 2.54,69.85 2.54,87.63 DIS1.18
N$105
  Top 0.406: IC4.11 6.35,60.96 6.99,61.59 6.99,62.87 6.99,64.14 1.91,69.22 1.91,89.53 DIS1.19
N$106
  Top 0.406: IC4.10 3.81,63.5 1.27,66.04 1.27,67.31 1.27,91.44 DIS1.20
N$108
  Top 0.406: IC4.7 14.61,58.42 15.88,57.15 R60.2
N$110
  Bottom 0.406: IC11.15 104.14,50.8 104.78,51.44 104.78,53.21 104.78,64.14 99.69,69.22 99.69,79.38 DIS8.15
N$111
  Bottom 0.406: IC11.16 104.14,48.26 105.41,49.53 105.41,51.94 105.41,64.77 100.33,69.85 100.33,77.47 DIS8.14
N$112
  Bottom 0.406: IC11.17 104.14,45.72 106.05,47.62 106.05,49.53 106.05,65.41 100.97,70.48 100.97,75.56 DIS8.13
N$113
  Bottom 0.406: IC11.18 104.14,43.18 106.68,45.72 106.68,46.74 106.68,66.04 101.6,71.12 101.6,73.66 DIS8.12
N$114
  Bottom 0.406: DIS8.11 107.31,67.94 107.31,45.72 107.31,45.09 109.22,43.18 IC11.1
N$115
  Top 0.406: IC11.14 104.14,53.34 106.68,55.88 106.68,57.15 106.68,66.04 101.6,71.12 101.6,83.82 DIS8.16
N$116
  Top 0.406: IC11.13 104.14,55.88 106.05,57.78 106.05,59.05 106.05,65.41 100.97,70.48 100.97,85.72 DIS8.17
N$117
  Top 0.406: IC11.12 104.14,58.42 105.41,59.69 105.41,60.96 105.41,64.77 100.33,69.85 100.33,87.63 DIS8.18
N$118
  Top 0.406: IC11.11 104.14,60.96 104.78,61.59 104.78,61.72 104.78,62.87 104.78,64.14 99.69,69.22 99.69,89.53 DIS8.19
N$119
  Top 0.406: IC11.10 101.6,63.5 99.06,66.04 99.06,67.31 99.06,91.44 DIS8.20
N$125
  Top 0.406: C18.2 R32.2 76.2,8.89 77.47,10.16 IC2.1
  Bottom 0.406: R32.2 71.12,21.59 66.04,26.67 66.04,30.48 64.77,31.75 39.37,31.75 36.83,34.29 D3.A
N$126
  Top 0.406: IC12.10 115.57,63.5 113.03,66.04 113.03,67.31 113.03,91.44 DIS9.20
N$130
  Top 0.406: IC2.2 80.01,10.16 R32.1 C14.2
N$131
  Bottom 0.406: IC13.15 132.08,50.8 132.72,51.44 132.72,64.14 127.64,69.22 127.64,79.38 DIS10.15
N$132
  Bottom 0.406: IC13.16 132.08,48.26 133.35,49.53 133.35,50.93 133.35,52.07 133.35,64.77 128.27,69.85 128.27,77.47 DIS10.14
N$133
  Top 0.406: IC1.8 53.34,22.86 54.61,24.13 R20.2 C10.2
  Bottom 0.406: C10.2 58.42,29.21 26.67,29.21 24.13,31.75 D1.A
N$134
  Top 0.406: IC1.9 50.8,22.86 R20.1 C8.2
N$135  (via drill 0.35)
  Top 0.406: IC2.14 77.47,22.86 76.2,24.13 R35.2 C21.2 v76.2,27.94
  Bottom 0.406: v76.2,27.94 D6.A
N$136
  Top 0.406: R17.2 C8.1 C10.1 R15.2
N$138
  Top 0.406: IC1.14 38.1,22.86 36.83,24.13 R21.2 C11.2 27.94,27.94 21.59,34.29 D2.A
N$139
  Top 0.406: C9.2 R21.1 40.64,22.86 IC1.13
N$140
  Top 0.406: R28.2 C14.1 C18.1 R24.2
N$141
  Top 0.406: R18.2 C9.1 C11.1 R16.2
N$144
  Top 0.406: IC2.7 92.71,10.16 93.98,8.89 R33.2 C19.2
  Bottom 0.406: IC2.7 92.71,15.24 91.44,16.51 76.2,16.51 74.93,17.78 74.93,30.48 72.39,33.02 52.07,33.02 50.8,34.29 D4.A
N$145
  Top 0.406: IC2.6 90.17,10.16 R33.1 C15.2
N$146
  Top 0.406: C17.2 R35.1 80.01,22.86 IC2.13
N$147
  Top 0.406: R29.2 C15.1 C19.1 R25.2
N$149
  Top 0.406: IC2.8 92.71,22.86 93.98,24.13 R34.2 C20.2 97.79,29.21 86.36,29.21 82.55,33.02 66.04,33.02 64.77,34.29 D5.A
N$150
  Top 0.406: IC2.9 90.17,22.86 R34.1 C16.2
N$151
  Top 0.406: IC3.1 116.84,10.16 115.57,8.89 R48.2 C30.2
  Bottom 0.406: R48.2 110.49,21.59 106.68,25.4 99.06,25.4 95.25,29.21 95.25,31.75 92.71,34.29 D8.A
N$152
  Top 0.406: R30.2 C16.1 C20.1 R26.2
N$154
  Top 0.406: R27.2 C21.1 C17.1 R31.2
N$156
  Top 0.406: IC3.2 119.38,10.16 R48.1 C26.2
N$157
  Top 0.406: R40.2 C30.1 C26.1 R44.2
N$159
  Top 0.406: C31.2 R49.2 133.35,8.89 132.08,10.16 IC3.7
  Bottom 0.406: IC3.7 132.08,15.24 130.81,16.51 118.11,16.51 114.3,20.32 114.3,22.86 110.49,26.67 107.95,26.67 104.14,30.48 D9.A
N$160
  Top 0.406: IC3.6 129.54,10.16 R49.1 C27.2
N$161
  Top 0.406: R45.2 C27.1 C31.1 R41.2
N$163
  Top 0.406: C32.2 R50.2 133.35,24.13 132.08,22.86 IC3.8
  Bottom 0.406: IC3.8 132.08,25.4 130.81,26.67 127,26.67 124.46,29.21 124.46,31.75 121.92,34.29 D10.A
N$164
  Top 0.406: IC3.9 129.54,22.86 R50.1 C28.2
N$165
  Top 0.406: R46.2 C28.1 C32.1 R42.2
N$167
  Top 0.406: IC3.14 116.84,22.86 115.57,24.13 | 115.57,24.13 R51.2 C33.2 | 115.57,24.13 115.57,27.94 116.84,29.21 123.19,29.21 128.27,34.29 D11.A
N$168
  Top 0.406: IC3.13 119.38,22.86 R51.1 C29.2
N$169
  Top 0.406: R43.2 C33.1 C29.1 R47.2
N$171
  Bottom 0.406: IC13.17 132.08,45.72 133.99,47.62 133.99,50.16 133.99,65.41 128.91,70.48 128.91,75.56 DIS10.13
N$172
  Bottom 0.406: IC13.18 132.08,43.18 134.62,45.72 134.62,66.04 129.54,71.12 129.54,73.66 DIS10.12
N$173
  Bottom 0.406: IC13.1 137.16,43.18 135.25,45.09 135.25,45.47 135.25,67.94 DIS10.11
N$174
  Top 0.406: IC13.14 132.08,53.34 134.62,55.88 134.62,57.15 134.62,66.04 129.54,71.12 129.54,83.82 DIS10.16
N$175
  Top 0.406: IC13.13 132.08,55.88 133.99,57.78 133.99,57.91 133.99,59.05 133.99,65.41 128.91,70.48 128.91,85.72 DIS10.17
N$176
  Top 0.406: IC13.12 132.08,58.42 133.35,59.69 133.35,60.96 133.35,64.77 128.27,69.85 128.27,87.63 DIS10.18
N$177
  Top 0.406: IC13.11 132.08,60.96 132.72,61.59 132.72,62.87 132.72,64.14 127.64,69.22 127.64,89.53 DIS10.19
N$178
  Top 0.406: DIS10.20 127,91.44 127,67.31 127,66.04 129.54,63.5 IC13.10
OUT1
  Top 0.406: IC4.5 14.61,51.44 14.61,36.2 R22.2 10.16,35.56 7.62,33.02 C12.+ D1.C
OUT2
  Top 0.406: IC5.5 28.57,51.44 28.57,38.73 C13.+ D2.C
  Bottom 0.406: IC5.5 28.57,53.34 29.84,52.07 R23.2
OUT3
  Top 0.406: IC6.5 42.55,51.44 42.55,38.73 C22.+ D3.C
  Bottom 0.406: IC6.5 42.55,53.34 43.81,52.07 R36.2
OUT4
  Top 0.406: IC7.5 56.52,51.44 56.52,38.73 C23.+ D4.C
  Bottom 0.406: IC7.5 56.52,53.34 57.78,52.07 R37.2
OUT5
  Top 0.406: IC8.5 70.48,51.44 70.48,38.73 C24.+ D5.C
  Bottom 0.406: IC8.5 70.48,53.34 71.75,52.07 R38.2
OUT6
  Top 0.406: IC9.5 84.45,51.44 84.45,38.73 C25.+ D6.C
  Bottom 0.406: IC9.5 84.45,53.34 85.72,52.07 R39.2
OUT7
  Top 0.406: IC10.5 98.42,51.44 98.42,38.73 C34.+ D8.C
  Bottom 0.406: IC10.5 98.42,53.34 99.69,52.07 R52.2
OUT8
  Top 0.406: IC11.5 112.39,51.44 112.39,38.73 C35.+ D9.C
  Bottom 0.406: IC11.5 112.39,53.34 113.67,52.07 R53.2
OUT9
  Top 0.406: IC12.5 126.36,51.44 126.36,38.73 C36.+ D10.C
  Bottom 0.406: IC12.5 126.36,53.34 127.64,52.07 R54.2
OUT10
  Top 0.406: IC13.5 139.7,53.34 140.34,52.7 140.34,38.73 C37.+ D11.C
  Bottom 0.406: IC13.5 140.34,53.34 141.6,52.07 R55.2
REF
  Top 0.406: D7.A 134.62,16.51 128.27,16.51 | 128.27,16.51 123.19,16.51 | 88.9,16.51 83.82,16.51 | 49.53,17.14 44.45,17.14 43.18,18.41 IC1.12 | IC1.10 48.26,18.41 49.53,17.14 | IC2.12 82.55,17.78 83.19,17.14 83.82,16.51 | IC2.10 87.63,17.78 88.9,16.51 | IC2.3 82.55,15.24 83.82,16.51 | IC2.5 87.63,15.24 88.9,16.51 | IC3.3 121.92,15.24 123.19,16.51 | IC3.12 121.92,17.78 | 121.92,17.78 123.19,16.51 | IC3.10 127,17.78 128.27,16.51 | IC3.5 127,15.24 128.27,16.51 | 88.9,16.51 R19.1 100.33,17.78 121.92,17.78 | 49.53,17.14 66.67,17.14 67.31,16.51 83.82,16.51
RHI  (via drill 0.35)
  Top 0.406: IC13.6 137.16,55.88 133.35,52.07 129.54,52.07 125.73,55.88 IC12.6 123.19,55.88 119.38,52.07 115.57,52.07 111.76,55.88 IC11.6 109.22,55.88 105.41,52.07 101.6,52.07 97.79,55.88 IC10.6 95.25,55.88 91.44,52.07 87.63,52.07 83.82,55.88 IC9.6 81.28,55.88 77.47,52.07 73.66,52.07 69.85,55.88 IC8.6 67.31,55.88 63.5,52.07 59.69,52.07 55.88,55.88 IC7.6 53.34,55.88 49.53,52.07 45.72,52.07 41.91,55.88 IC6.6 39.37,55.88 35.56,52.07 31.75,52.07 27.94,55.88 IC5.6 25.4,55.88 21.59,52.07 17.14,52.07 | 17.14,52.07 R59.2 15.88,53.98 13.97,55.88 IC4.6 | 17.14,52.07 17.14,44.45 R58.1 v15.88,39.37
  Bottom 0.406: v15.88,39.37 10.79,34.29 TP4.TP
RLO  (via drill 0.35)
  Top 0.406: IC13.4 137.16,50.8 135.89,49.53 v129.54,49.53 | IC12.4 123.19,50.8 121.92,49.53 v115.57,49.53 | IC11.4 109.22,50.8 107.95,49.53 v101.6,49.53 | IC10.4 95.25,50.8 93.98,49.53 v87.63,49.53 | IC9.4 81.28,50.8 80.01,49.53 v73.66,49.53 | IC8.4 67.31,50.8 66.04,49.53 v59.69,49.53 | IC7.4 53.34,50.8 52.07,49.53 v45.72,49.53 | IC6.4 39.37,50.8 38.1,49.53 v31.75,49.53 | IC5.4 25.4,50.8 24.13,49.53 v17.88,49.53 | R57.2 R56.1 7.62,46.99 11.43,50.8 IC4.4 | v6.35,37.47 7.62,36.2 7.62,34.29 v6.73,33.4
  Bottom 0.406: IC12.4 125.73,50.8 127,49.53 v129.54,49.53 | v115.57,49.53 113.03,49.53 111.76,50.8 IC11.4 | v101.6,49.53 99.06,49.53 97.79,50.8 IC10.4 | v87.63,49.53 85.09,49.53 83.82,50.8 IC9.4 | v73.66,49.53 71.12,49.53 69.85,50.8 IC8.4 | v59.69,49.53 57.15,49.53 55.88,50.8 IC7.4 | v45.72,49.53 43.18,49.53 41.91,50.8 IC6.4 | v31.75,49.53 29.21,49.53 27.94,50.8 IC5.4 | v17.88,49.53 15.24,49.53 13.97,50.8 IC4.4 | R56.1 1.91,41.91 v6.35,37.47 | v6.73,33.4 2.67,29.34 TP5.TP
V+  (via drill 0.5)
  Top 0.813: v90.17,15.24 105.41,15.24 R19.2 110.49,16.51 C7.1 | C6.1 67.31,7.62 57.15,7.62 | 45.72,11.43 46.99,10.16 50.8,10.16 53.34,7.62 57.15,7.62 | 5.08,38.1 C38.1 10.16,43.18 10.16,46.99 11.43,48.26 IC4.3 | DIS1.1 DIS1.2 DIS1.3 DIS1.4 DIS1.5 DIS1.6 DIS1.7 DIS1.8 DIS1.9 DIS1.10 IC4.9 | IC6.3 39.37,48.26 38.1,46.99 38.1,43.18 C41.1 | DIS3.1 DIS3.2 DIS3.3 DIS3.4 DIS3.5 DIS3.6 DIS3.7 DIS3.8 DIS3.9 DIS3.10 IC6.9 | DIS2.1 DIS2.2 DIS2.3 DIS2.4 DIS2.5 DIS2.6 DIS2.7 DIS2.8 DIS2.9 DIS2.10 IC5.9 | IC7.3 53.34,48.26 52.07,46.99 52.07,43.18 C40.1 | DIS4.1 DIS4.2 DIS4.3 DIS4.4 DIS4.5 DIS4.6 DIS4.7 DIS4.8 DIS4.9 DIS4.10 IC7.9 | DIS5.1 DIS5.2 DIS5.3 DIS5.4 DIS5.5 DIS5.6 DIS5.7 DIS5.8 DIS5.9 DIS5.10 IC8.9 | DIS7.1 DIS7.2 DIS7.3 DIS7.4 DIS7.5 DIS7.6 DIS7.7 DIS7.8 DIS7.9 DIS7.10 IC10.9 | DIS6.1 DIS6.2 DIS6.3 DIS6.4 DIS6.5 DIS6.6 DIS6.7 DIS6.8 DIS6.9 DIS6.10 IC9.9 | DIS8.1 DIS8.2 DIS8.3 DIS8.4 DIS8.5 DIS8.6 DIS8.7 DIS8.8 DIS8.9 DIS8.10 IC11.9 | DIS9.1 DIS9.2 DIS9.3 DIS9.4 DIS9.5 DIS9.6 DIS9.7 DIS9.8 DIS9.9 DIS9.10 IC12.9 | DIS10.1 DIS10.2 DIS10.3 DIS10.4 DIS10.5 DIS10.6 DIS10.7 DIS10.8 DIS10.9 DIS10.10 IC13.9 | 5.08,38.1 5.08,26.67 R1.2 1.91,23.5 1.91,18.41 6.35,13.97 10.16,13.97 13.64,10.49 J2.1 20.32,7.62 R9.2 25.4,5.08 35.56,5.08 36.83,3.81 40.64,3.81 41.91,5.08 41.91,7.62 45.72,11.43 | IC5.3 25.4,48.26 24.13,46.99 24.13,43.18 C39.1 20.32,38.1 17.78,35.56 R58.2 | IC8.3 67.31,48.26 66.04,46.99 66.04,43.18 C42.1 | IC9.3 81.28,48.26 80.01,46.99 80.01,43.18 C43.1 | IC10.3 95.25,48.26 93.98,46.99 93.98,43.18 C45.1 | IC11.3 109.22,48.26 107.95,46.99 107.95,43.18 C44.1
  Top 0.813: IC12.3 123.19,48.26 121.92,46.99 121.92,43.18 C46.1 | C47.1 135.89,43.18 135.89,46.99 137.16,48.26 IC13.3 | IC1.4 45.72,11.43 | v72.39,17.78 68.58,17.78 R6.2 | C5.1 57.15,7.62 | R56.2 3.81,39.37 5.08,38.1
  Bottom 0.813: TP1.TP 104.14,19.05 R19.2 | v90.17,15.24 86.36,15.24 85.09,13.97 | 85.09,13.97 IC2.4 | 85.09,13.97 83.82,15.24 74.93,15.24 C6.1 72.39,15.24 v72.39,17.78 | IC3.4 124.46,13.97 123.19,15.24 114.3,15.24 C7.1 | C47.1 130.81,40.64 119.38,40.64 C46.1 116.84,40.64 105.41,40.64 C44.1 102.87,40.64 91.44,40.64 C45.1 88.9,40.64 77.47,40.64 C43.1 74.93,40.64 63.5,40.64 C42.1 60.96,40.64 49.53,40.64 C40.1 46.99,40.64 35.56,40.64 C41.1 33.02,40.64 21.59,40.64 C39.1 19.05,40.64 7.62,40.64 C38.1 | IC13.3 137.16,48.26 136.14,49.28 136.14,62.48 137.16,63.5 IC13.9 | IC12.9 123.19,63.5 122.17,62.48 122.17,49.28 123.19,48.26 IC12.3 | IC11.9 109.22,63.5 108.2,62.48 108.2,49.28 109.22,48.26 IC11.3 | IC10.9 95.25,63.5 94.23,62.48 94.23,49.28 95.25,48.26 IC10.3 | IC9.9 81.28,63.5 80.26,62.48 80.26,49.28 81.28,48.26 IC9.3 | IC8.9 67.31,63.5 66.29,62.48 66.29,49.28 67.31,48.26 IC8.3 | IC7.9 53.34,63.5 52.32,62.48 52.32,49.28 53.34,48.26 IC7.3 | IC6.9 39.37,63.5 38.35,62.48 38.35,49.28 39.37,48.26 IC6.3 | IC5.9 25.4,63.5 24.38,62.48 24.38,49.28 25.4,48.26 IC5.3 | IC4.9 11.43,63.5 10.41,62.48 10.41,49.28 11.43,48.26 IC4.3
VER
  Top 0.406: R15.1 R27.1 | R26.1 R43.1 | R25.1 R40.1 | R42.1 R41.1 | C4.- 29.21,21.59 R16.1 25.4,22.86 R14.2
  Bottom 0.406: R41.1 139.7,7.62 109.22,7.62 R40.1 107.95,11.43 TP3.TP 107.95,21.59 R43.1 | R25.1 100.33,7.62 69.85,7.62 R24.1 R27.1 | R16.1 30.48,25.4 60.96,25.4 R15.1

### Text on the board
tPlace: RHI | RLO | V+ | GND | VER
tNames: 32 Hz | 64 Hz | 128 Hz | 256 Hz | 512 Hz | 1 kHz | 2 kHz | 4 kHz | 8 kHz | 16 kHz | DC IN
bNames: von Jakob Holz | Audio Spektrum Analysator